# EAGLE schematic cft (EAGLE 5.11), part 6 of 7
## Sheet 44 of 49
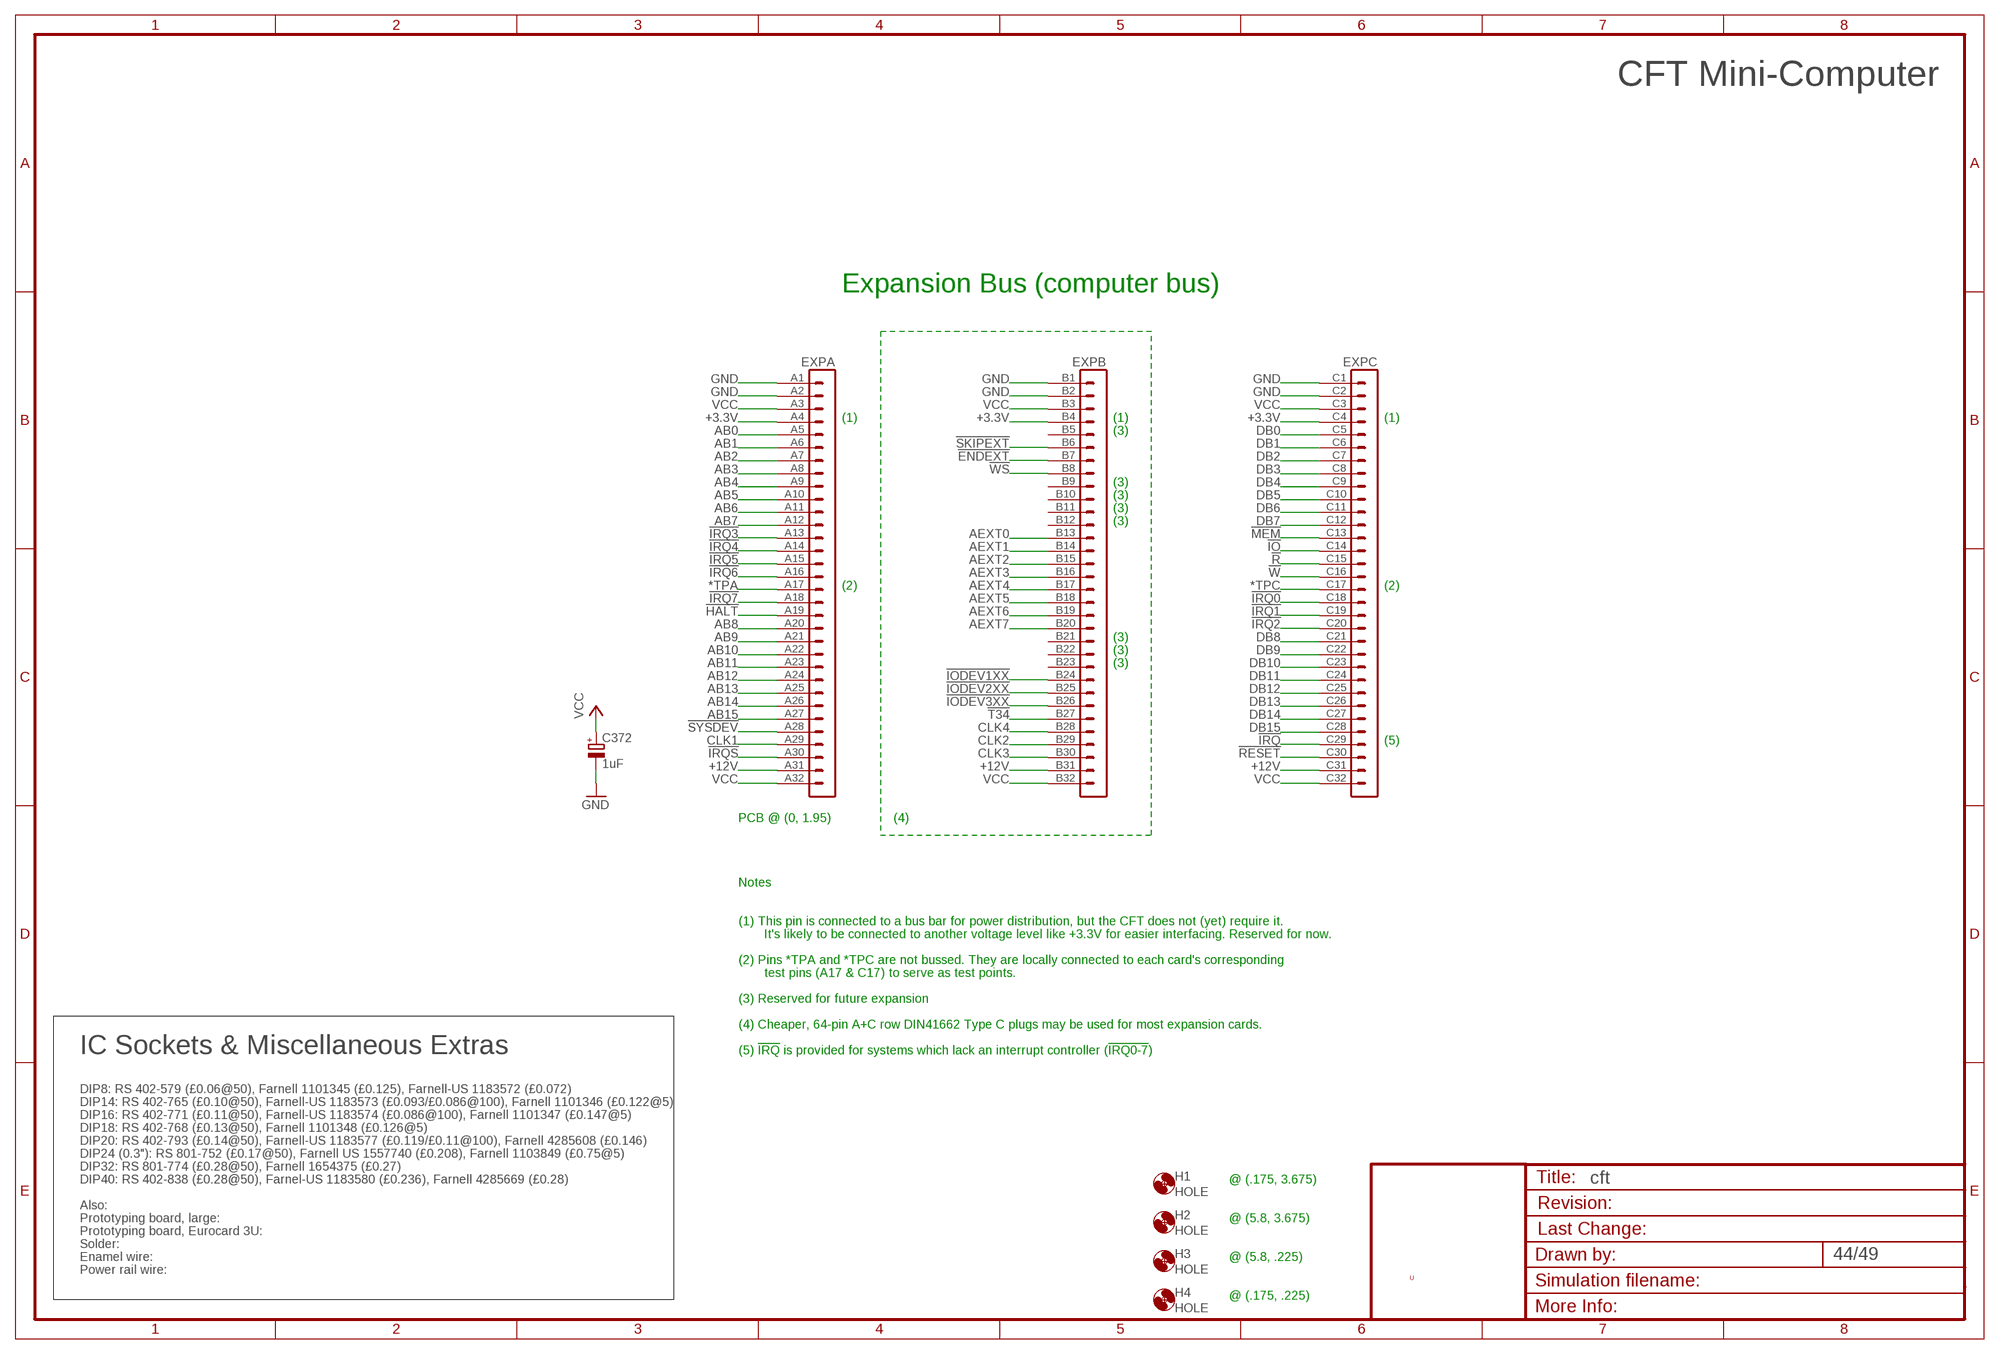
[diagram p43: schematic, sheet 44]

### Parts
C372  1uF  CPOL-EUE2.5-5  [E2,5-5]
EXP  VG96-3K  [VG96K]
H1  HOLE  [STANDOFF_28_60]
H2  HOLE  [STANDOFF_28_60]
H3  HOLE  [STANDOFF_28_60]
H4  HOLE  [STANDOFF_28_60]

### Nets
!ENDEXT: EXP.B7 ; also sheet 4,45,46
!HALT: EXP.A19 ; also sheet 4,43,45,46
!IO: EXP.C14 ; also sheet 4,5,6,12,13,42,45,46
!IODEV1XX: EXP.B24 ; also sheet 13,45,46,47,48
!IODEV2XX: EXP.B25 ; also sheet 13,45,46
!IODEV3XX: EXP.B26 ; also sheet 13,45,46
!IRQ: EXP.C29 ; also sheet 11,22,25,26,27,28,29,30,47
!IRQ0: EXP.C18 ; also sheet 22,25,27,30,45,46
!IRQ1: EXP.C19 ; also sheet 22,25,27,30,45,46
!IRQ2: EXP.C20 ; also sheet 22,25,27,29,30,45,46,47
!IRQ3: EXP.A13 ; also sheet 22,25,29,30,45,46,47
!IRQ4: EXP.A14 ; also sheet 22,25,29,30,45,46,47
!IRQ5: EXP.A15 ; also sheet 22,25,26,28,30,45,46
!IRQ6: EXP.A16 ; also sheet 22,25,26,28,30,45,46
!IRQ7: EXP.A18 ; also sheet 22,25,26,28,30,45,46
!IRQS: EXP.A30 ; also sheet 4,6,11,20,40,45,46
!MEM: EXP.C13 ; also sheet 4,5,6,12,13,21,24,42,45,46
!R: EXP.C15 ; also sheet 4,5,6,12,22,24,25,26,27,28,29,30,41,42,45,46,47,48
!RESET: EXP.C30 ; also sheet 2,3,4,7,8,10,11,12,13,14,17,18,19,20,21,22,25,26,28,29,30,31,45,46,47
!SKIPEXT: EXP.B6 ; also sheet 8,45,46
!SYSDEV: EXP.A28 ; also sheet 13,21,22,25,26,27,28,29,30,41,45,46
!T34: EXP.B27 ; also sheet 2,12,18,45,46
!W: EXP.C16 ; also sheet 12,21,22,24,25,26,27,28,29,30,41,45,46,47,48
!WS: EXP.B8 ; also sheet 4,12,45,46
*TPA: EXP.A17 ; also sheet 45
*TPC: EXP.C17 ; also sheet 45
+3.3V: EXP.A4 EXP.B4 EXP.C4 ; also sheet 45
+12V [LED power]: EXP.A31 EXP.B31 EXP.C31 ; also sheet 28,45
AB0: EXP.A5 ; also sheet 13,21,24,25,26,27,28,29,30,41,45,46,47,48
AB1: EXP.A6 ; also sheet 13,21,24,25,26,27,28,29,30,41,45,46,47,48
AB2: EXP.A7 ; also sheet 13,21,24,25,26,27,29,30,41,45,46,47,48
AB3: EXP.A8 ; also sheet 13,24,25,26,27,28,29,30,41,45,46,47,48
AB4: EXP.A9 ; also sheet 13,22,24,25,26,27,28,29,30,41,45,46,47,48
AB5: EXP.A10 ; also sheet 13,21,22,24,25,26,27,28,29,30,41,45,46,47,48
AB6: EXP.A11 ; also sheet 13,21,22,24,25,26,27,28,29,30,41,45,46,47,48
AB7: EXP.A12 ; also sheet 13,21,22,24,25,26,27,28,29,30,41,45,46,47,48
AB8: EXP.A20 ; also sheet 13,24,45,46
AB9: EXP.A21 ; also sheet 13,24,45,46
AB10: EXP.A22 ; also sheet 13,24,45,46
AB11: EXP.A23 ; also sheet 13,24,45,46
AB12: EXP.A24 ; also sheet 13,24,45,46
AB13: EXP.A25 ; also sheet 13,21,45,46
AB14: EXP.A26 ; also sheet 13,21,45,46
AB15: EXP.A27 ; also sheet 13,21,45,46
AEXT0: EXP.B13 ; also sheet 21,24,45,46
AEXT1: EXP.B14 ; also sheet 21,24,45,46
AEXT2: EXP.B15 ; also sheet 21,24,45,46
AEXT3: EXP.B16 ; also sheet 21,24,45,46
AEXT4: EXP.B17 ; also sheet 21,24,45,46
AEXT5: EXP.B18 ; also sheet 21,24,45,46
AEXT6: EXP.B19 ; also sheet 21,24,45,46
AEXT7: EXP.B20 ; also sheet 21,24,45,46
CLK1: EXP.A29 ; also sheet 2,7,27,31,43,45,46
CLK2: EXP.B29 ; also sheet 2,12,45,46
CLK3: EXP.B30 ; also sheet 2,3,7,17,19,45,46
CLK4: EXP.B28 ; also sheet 2,4,8,12,45,46
DB0: EXP.C5 ; also sheet 12,21,22,24,25,26,27,28,29,30,31,41,45,46,47,48
DB1: EXP.C6 ; also sheet 12,21,22,24,25,26,27,28,29,30,31,41,45,46,47,48
DB2: EXP.C7 ; also sheet 12,21,22,24,25,26,27,28,29,30,31,41,45,46,47,48
DB3: EXP.C8 ; also sheet 12,21,22,24,25,26,27,28,29,30,31,41,45,46,47,48
DB4: EXP.C9 ; also sheet 12,21,22,24,25,26,27,28,29,30,31,41,45,46,47,48
DB5: EXP.C10 ; also sheet 12,21,22,24,25,26,27,28,29,30,31,41,45,46,47,48
DB6: EXP.C11 ; also sheet 12,21,22,24,25,26,27,28,29,30,31,41,45,46,47,48
DB7: EXP.C12 ; also sheet 12,21,22,24,25,26,27,28,29,30,31,41,45,46,47,48
DB8: EXP.C21 ; also sheet 12,21,24,26,27,29,30,31,41,45,46,48
DB9: EXP.C22 ; also sheet 12,24,26,27,29,30,41,45,46,48
DB10: EXP.C23 ; also sheet 12,24,26,27,29,30,41,45,46,48
DB11: EXP.C24 ; also sheet 12,24,26,27,29,30,41,45,46,48
DB12: EXP.C25 ; also sheet 12,24,26,27,29,30,41,45,46,48
DB13: EXP.C26 ; also sheet 12,24,26,27,29,30,41,45,46,48
DB14: EXP.C27 ; also sheet 12,24,26,27,29,30,41,45,46,48
DB15: EXP.C28 ; also sheet 12,24,26,27,29,30,41,45,46,48
GND [low power]: C372.- EXP.A1 EXP.A2 EXP.B1 EXP.B2 EXP.C1 EXP.C2 ; also sheet 2,3,4,5,6,7,8,9,10,11,12,13,14,15,16,17,18,19,20,21,22,24,25,26,27,28,29,30,31,32,33,34,35,36,37,38,39,40,41,42,43,45,46,47,48,49
VCC [low power]: C372.+ EXP.A3 EXP.A32 EXP.B3 EXP.B32 EXP.C3 EXP.C32 ; also sheet 2,3,4,6,7,8,9,10,11,12,13,14,15,16,17,18,19,20,21,22,24,25,26,27,28,29,30,31,34,35,36,37,38,39,40,41,42,43,45,46,47,48,49
Unconnected: EXP.B5 EXP.B9 EXP.B10 EXP.B11 EXP.B12 EXP.B21 EXP.B22 EXP.B23

### Notes on the sheet
- CFT Mini-Computer
- Expansion Bus (computer bus)
- (1) | (1) | (1)
- (3)
- (3)
- (3)
- (3)
- (3)
- (2) | (2)
- (3)
- (3)
- (3)
- (5)
- PCB @ (0, 1.95) | (4)
- Notes
- (1) This pin is connected to a bus bar for power distribution, but the CFT does not (yet) require it.
- It's likely to be connected to another voltage level like +3.3V for easier interfacing. Reserved for now.
- (2) Pins *TPA and *TPC are not bussed. They are locally connected to each card's corresponding
- test pins (A17 & C17) to serve as test points.
- (3) Reserved for future expansion
- (4) Cheaper, 64-pin A+C row DIN41662 Type C plugs may be used for most expansion cards.
- IC Sockets & Miscellaneous Extras | (5) !IRQ! is provided for systems which lack an interrupt controller (!IRQ0-7!)
- DIP8: RS 402-579 (£0.06@50), Farnell 1101345 (£0.125), Farnell-US 1183572 (£0.072)
- DIP14: RS 402-765 (£0.10@50), Farnell-US 1183573 (£0.093/£0.086@100), Farnell 1101346 (£0.122@5)
- DIP16: RS 402-771 (£0.11@50), Farnell-US 1183574 (£0.086@100), Farnell 1101347 (£0.147@5)
- DIP18: RS 402-768 (£0.13@50), Farnell 1101348 (£0.126@5)
- DIP20: RS 402-793 (£0.14@50), Farnell-US 1183577 (£0.119/£0.11@100), Farnell 4285608 (£0.146)
- DIP24 (0.3"): RS 801-752 (£0.17@50), Farnell US 1557740 (£0.208), Farnell 1103849 (£0.75@5)
- DIP32: RS 801-774 (£0.28@50), Farnell 1654375 (£0.27)
- DIP40: RS 402-838 (£0.28@50), Farnel-US 1183580 (£0.236), Farnell 4285669 (£0.28) | @ (.175, 3.675)
- Also:
- Prototyping board, large: | @ (5.8, 3.675)
- Prototyping board, Eurocard 3U:
- Solder:
- Enamel wire: | @ (5.8, .225)
- Power rail wire:
- U
- @ (.175, .225)

## Sheet 45 of 49
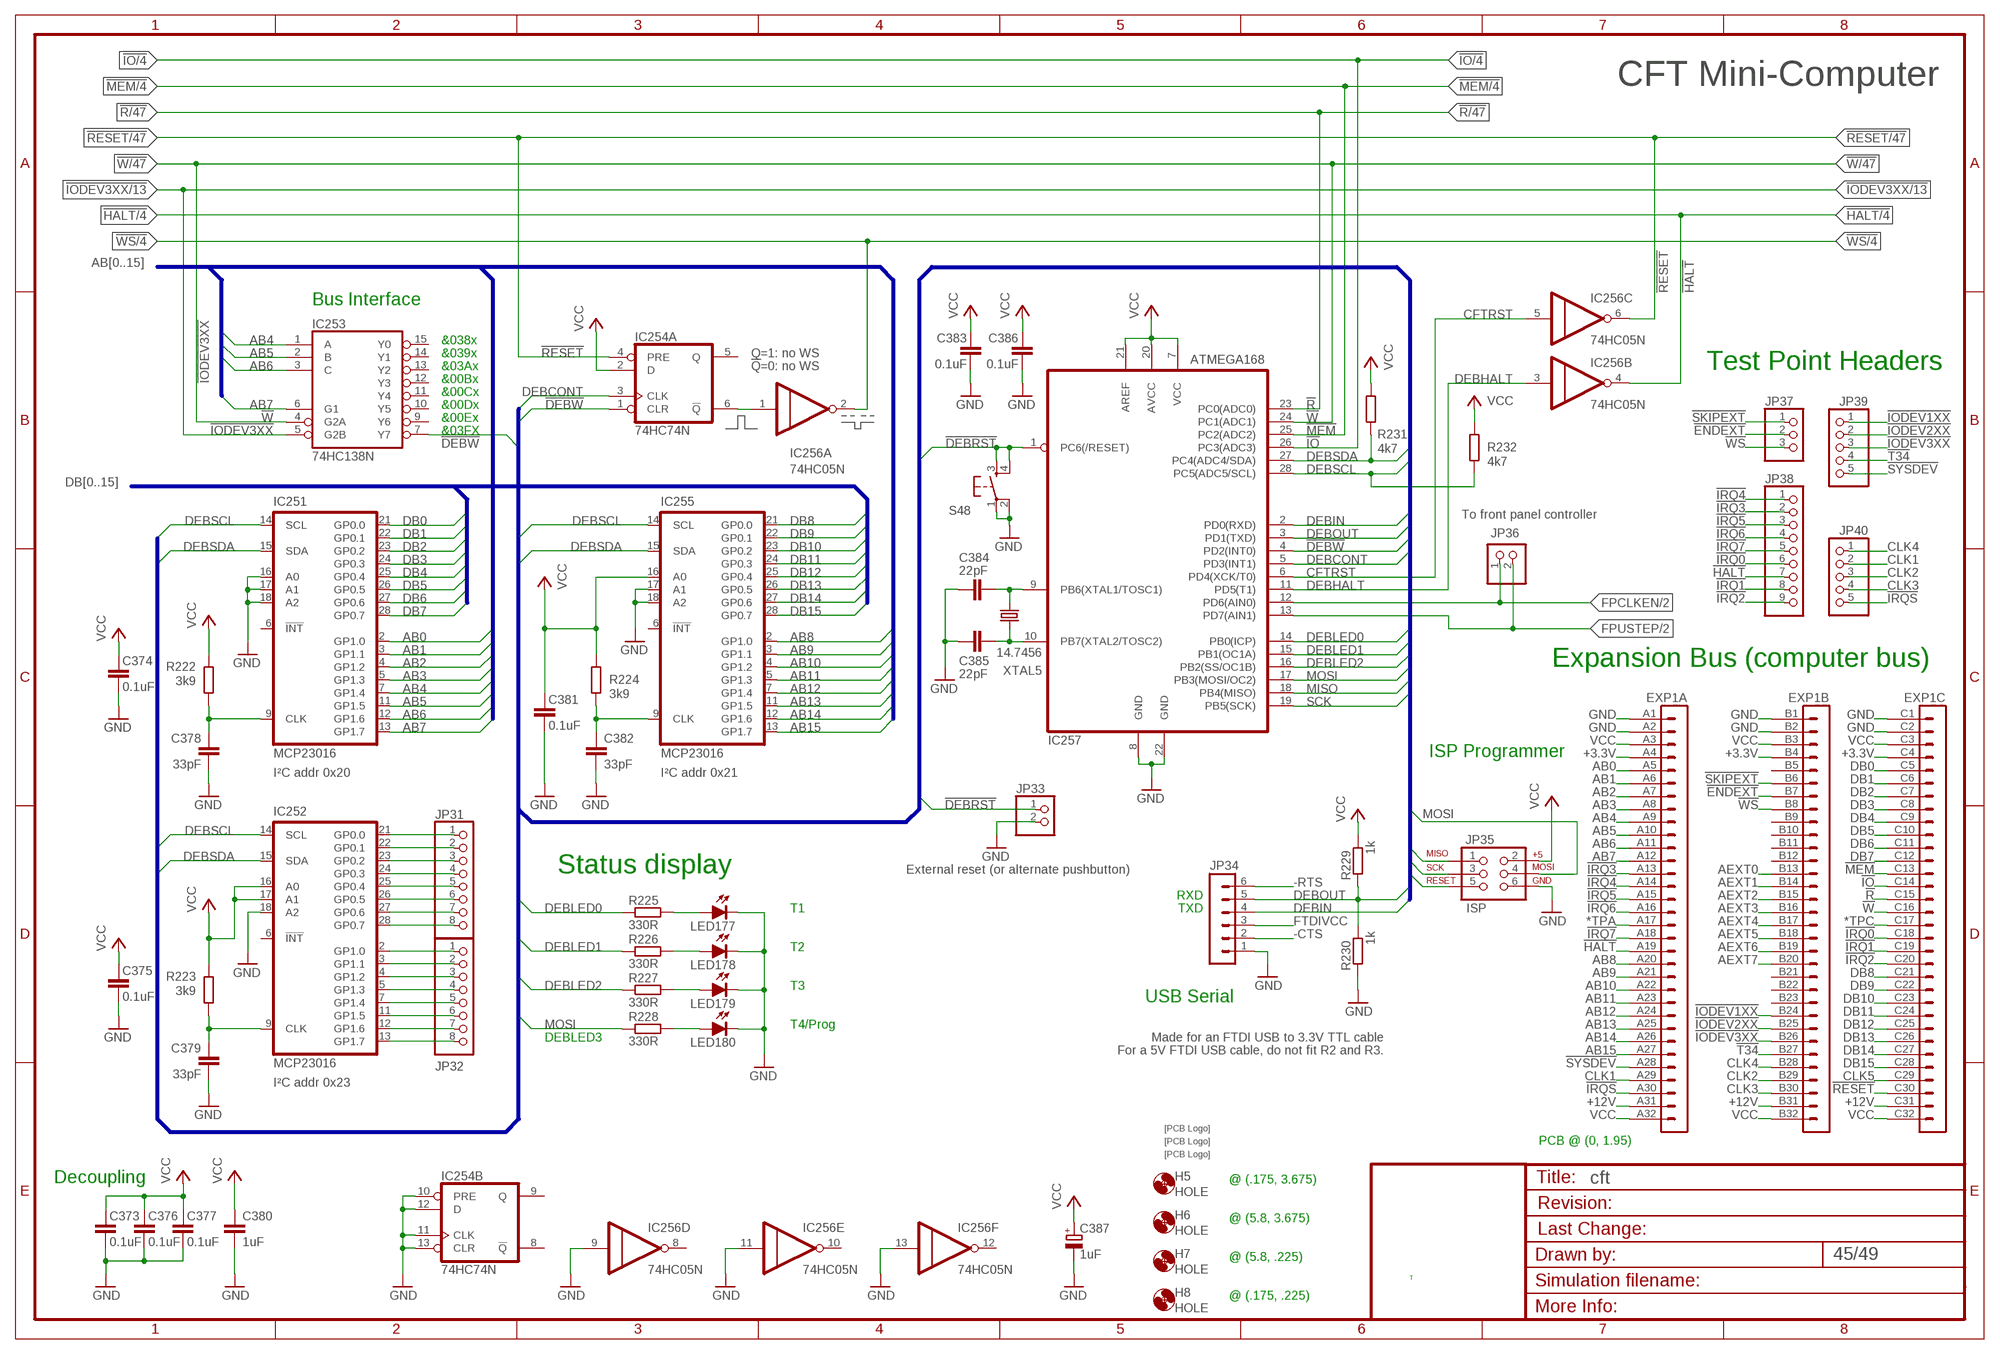
[diagram p44: schematic, sheet 45]

### Parts
C373  0.1uF  C-EU025-024X044  [C025-024X044]
C374  0.1uF  C-EU025-024X044  [C025-024X044]
C375  0.1uF  C-EU025-024X044  [C025-024X044]
C376  0.1uF  C-EU025-024X044  [C025-024X044]
C377  0.1uF  C-EU025-024X044  [C025-024X044]
C378  33pF  C-EU025-024X044  [C025-024X044]
C379  33pF  C-EU025-024X044  [C025-024X044]
C380  1uF  C-EU025-024X044  [C025-024X044]
C381  0.1uF  C-EU025-024X044  [C025-024X044]
C382  33pF  C-EU025-024X044  [C025-024X044]
C383  0.1uF  C-EU025-024X044  [C025-024X044]
C384  22pF  C-EU025-024X044  [C025-024X044]
C385  22pF  C-EU025-024X044  [C025-024X044]
C386  0.1uF  C-EU025-024X044  [C025-024X044]
C387  1uF  CPOL-EUE2.5-5  [E2,5-5]
EXP1  VG96-3K  [VG96K]
H5  HOLE  [STANDOFF_28_60]
H6  HOLE  [STANDOFF_28_60]
H7  HOLE  [STANDOFF_28_60]
H8  HOLE  [STANDOFF_28_60]
IC251  MCP23016  [DIL28-6]
IC252  MCP23016  [DIL28-6]
IC253  74HC138N  [DIL16]
IC254  74HC74N  [DIL14]
IC255  MCP23016  [DIL28-6]
IC256  74HC05N  [DIL14]
IC257  ATMEGA168  MEGA8-P  [DIL28-3]
JP31  PINHD-1X8  [1X08]
JP32  PINHD-1X8  [1X08]
JP33  PINHD-1X2  [1X02]
JP34  MA06-1  [MA06-1]
JP35  ISP  AVR_SPI_PRG_6NS  [2X3-NS]
JP36  PINHD-1X2  [1X02]
JP37  PINHD-1X3  [1X03]
JP38  PINHD-1X9  [1X09]
JP39  PINHD-1X5  [1X05]
JP40  PINHD-1X5  [1X05]
LED177  LED-5MM-RED  [LED5MM]
LED178  LED-5MM-RED  [LED5MM]
LED179  LED-5MM-RED  [LED5MM]
LED180  LED-5MM-RED  [LED5MM]
R222  3k9  R-EU_0207/7  [0207/7]
R223  3k9  R-EU_0207/7  [0207/7]
R224  3k9  R-EU_0207/7  [0207/7]
R225  330R  R-EU_0207/7  [0207/7]
R226  330R  R-EU_0207/7  [0207/7]
R227  330R  R-EU_0207/7  [0207/7]
R228  330R  R-EU_0207/7  [0207/7]
R229  1k  R-EU_0207/7  [0207/7]
R230  1k  R-EU_0207/7  [0207/7]
R231  4k7  R-EU_0207/7  [0207/7]
R232  4k7  R-EU_0207/7  [0207/7]
S48  TAC_SWITCHPTH  [TACTILE-PTH]
U$1  SIGNATURESILK  [SIGNATURE]
U$2  SIGNATUREPLANE  [SIGNATURE_PLANE]
U$3  SIGNATUREPLANE  [SIGNATURE_PLANE]
XTAL5  14.7456  CRYSTALHC49U-V  [HC49U-V]

### Nets
!DEBRST: IC257.1(PC6(/RESET)) JP33.1 JP35.5 S48.3 S48.4
!DEBW: IC253.7(Y7) IC254.1(A:CLR) IC257.4(PD2(INT0))
!ENDEXT: EXP1.B7 JP37.2 ; also sheet 4,44,46
!HALT: EXP1.A19 IC256.4(B:O) JP38.7 ; also sheet 4,43,44,46
!IO: EXP1.C14 IC257.26(PC3(ADC3)) ; also sheet 4,5,6,12,13,42,44,46
!IODEV1XX: EXP1.B24 JP39.1 ; also sheet 13,44,46,47,48
!IODEV2XX: EXP1.B25 JP39.2 ; also sheet 13,44,46
!IODEV3XX: EXP1.B26 IC253.5(G2B) JP39.3 ; also sheet 13,44,46
!IRQ0: EXP1.C18 JP38.6 ; also sheet 22,25,27,30,44,46
!IRQ1: EXP1.C19 JP38.8 ; also sheet 22,25,27,30,44,46
!IRQ2: EXP1.C20 JP38.9 ; also sheet 22,25,27,29,30,44,46,47
!IRQ3: EXP1.A13 JP38.2 ; also sheet 22,25,29,30,44,46,47
!IRQ4: EXP1.A14 JP38.1 ; also sheet 22,25,29,30,44,46,47
!IRQ5: EXP1.A15 JP38.3 ; also sheet 22,25,26,28,30,44,46
!IRQ6: EXP1.A16 JP38.4 ; also sheet 22,25,26,28,30,44,46
!IRQ7: EXP1.A18 JP38.5 ; also sheet 22,25,26,28,30,44,46
!IRQS: EXP1.A30 JP40.5 ; also sheet 4,6,11,20,40,44,46
!MEM: EXP1.C13 IC257.25(PC2(ADC2)) ; also sheet 4,5,6,12,13,21,24,42,44,46
!R: EXP1.C15 IC257.23(PC0(ADC0)) ; also sheet 4,5,6,12,22,24,25,26,27,28,29,30,41,42,44,46,47,48
!RESET: EXP1.C30 IC254.4(A:PRE) IC256.6(C:O) ; also sheet 2,3,4,7,8,10,11,12,13,14,17,18,19,20,21,22,25,26,28,29,30,31,44,46,47
!SKIPEXT: EXP1.B6 JP37.1 ; also sheet 8,44,46
!SYSDEV: EXP1.A28 JP39.5 ; also sheet 13,21,22,25,26,27,28,29,30,41,44,46
!T34: EXP1.B27 JP39.4 ; also sheet 2,12,18,44,46
!W: EXP1.C16 IC253.4(G2A) IC257.24(PC1(ADC1)) ; also sheet 12,21,22,24,25,26,27,28,29,30,41,44,46,47,48
!WS: EXP1.B8 IC256.2(A:O) JP37.3 ; also sheet 4,12,44,46
*TPA: EXP1.A17 ; also sheet 44
*TPC: EXP1.C17 ; also sheet 44
+3.3V: EXP1.A4 EXP1.B4 EXP1.C4 ; also sheet 44
+12V [LED power]: EXP1.A31 EXP1.B31 EXP1.C31 ; also sheet 28,44
-CTS: JP34.2
-RTS: JP34.6
AB0: EXP1.A5 IC251.2(GP1.0) ; also sheet 13,21,24,25,26,27,28,29,30,41,44,46,47,48
AB1: EXP1.A6 IC251.3(GP1.1) ; also sheet 13,21,24,25,26,27,28,29,30,41,44,46,47,48
AB2: EXP1.A7 IC251.4(GP1.2) ; also sheet 13,21,24,25,26,27,29,30,41,44,46,47,48
AB3: EXP1.A8 IC251.5(GP1.3) ; also sheet 13,24,25,26,27,28,29,30,41,44,46,47,48
AB4: EXP1.A9 IC251.7(GP1.4) IC253.1(A) ; also sheet 13,22,24,25,26,27,28,29,30,41,44,46,47,48
AB5: EXP1.A10 IC251.11(GP1.5) IC253.2(B) ; also sheet 13,21,22,24,25,26,27,28,29,30,41,44,46,47,48
AB6: EXP1.A11 IC251.12(GP1.6) IC253.3(C) ; also sheet 13,21,22,24,25,26,27,28,29,30,41,44,46,47,48
AB7: EXP1.A12 IC251.13(GP1.7) IC253.6(G1) ; also sheet 13,21,22,24,25,26,27,28,29,30,41,44,46,47,48
AB8: EXP1.A20 IC255.2(GP1.0) ; also sheet 13,24,44,46
AB9: EXP1.A21 IC255.3(GP1.1) ; also sheet 13,24,44,46
AB10: EXP1.A22 IC255.4(GP1.2) ; also sheet 13,24,44,46
AB11: EXP1.A23 IC255.5(GP1.3) ; also sheet 13,24,44,46
AB12: EXP1.A24 IC255.7(GP1.4) ; also sheet 13,24,44,46
AB13: EXP1.A25 IC255.11(GP1.5) ; also sheet 13,21,44,46
AB14: EXP1.A26 IC255.12(GP1.6) ; also sheet 13,21,44,46
AB15: EXP1.A27 IC255.13(GP1.7) ; also sheet 13,21,44,46
AEXT0: EXP1.B13 ; also sheet 21,24,44,46
AEXT1: EXP1.B14 ; also sheet 21,24,44,46
AEXT2: EXP1.B15 ; also sheet 21,24,44,46
AEXT3: EXP1.B16 ; also sheet 21,24,44,46
AEXT4: EXP1.B17 ; also sheet 21,24,44,46
AEXT5: EXP1.B18 ; also sheet 21,24,44,46
AEXT6: EXP1.B19 ; also sheet 21,24,44,46
AEXT7: EXP1.B20 ; also sheet 21,24,44,46
CFTRST: IC256.5(C:I) IC257.6(PD4(XCK/T0))
CLK1: EXP1.A29 JP40.2 ; also sheet 2,7,27,31,43,44,46
CLK2: EXP1.B29 JP40.3 ; also sheet 2,12,44,46
CLK3: EXP1.B30 JP40.4 ; also sheet 2,3,7,17,19,44,46
CLK4: EXP1.B28 JP40.1 ; also sheet 2,4,8,12,44,46
CLK5: EXP1.C29
DB0: EXP1.C5 IC251.21(GP0.0) ; also sheet 12,21,22,24,25,26,27,28,29,30,31,41,44,46,47,48
DB1: EXP1.C6 IC251.22(GP0.1) ; also sheet 12,21,22,24,25,26,27,28,29,30,31,41,44,46,47,48
DB2: EXP1.C7 IC251.23(GP0.2) ; also sheet 12,21,22,24,25,26,27,28,29,30,31,41,44,46,47,48
DB3: EXP1.C8 IC251.24(GP0.3) ; also sheet 12,21,22,24,25,26,27,28,29,30,31,41,44,46,47,48
DB4: EXP1.C9 IC251.25(GP0.4) ; also sheet 12,21,22,24,25,26,27,28,29,30,31,41,44,46,47,48
DB5: EXP1.C10 IC251.26(GP0.5) ; also sheet 12,21,22,24,25,26,27,28,29,30,31,41,44,46,47,48
DB6: EXP1.C11 IC251.27(GP0.6) ; also sheet 12,21,22,24,25,26,27,28,29,30,31,41,44,46,47,48
DB7: EXP1.C12 IC251.28(GP0.7) ; also sheet 12,21,22,24,25,26,27,28,29,30,31,41,44,46,47,48
DB8: EXP1.C21 IC255.21(GP0.0) ; also sheet 12,21,24,26,27,29,30,31,41,44,46,48
DB9: EXP1.C22 IC255.22(GP0.1) ; also sheet 12,24,26,27,29,30,41,44,46,48
DB10: EXP1.C23 IC255.23(GP0.2) ; also sheet 12,24,26,27,29,30,41,44,46,48
DB11: EXP1.C24 IC255.24(GP0.3) ; also sheet 12,24,26,27,29,30,41,44,46,48
DB12: EXP1.C25 IC255.25(GP0.4) ; also sheet 12,24,26,27,29,30,41,44,46,48
DB13: EXP1.C26 IC255.26(GP0.5) ; also sheet 12,24,26,27,29,30,41,44,46,48
DB14: EXP1.C27 IC255.27(GP0.6) ; also sheet 12,24,26,27,29,30,41,44,46,48
DB15: EXP1.C28 IC255.28(GP0.7) ; also sheet 12,24,26,27,29,30,41,44,46,48
DEBCONT: IC254.3(A:CLK) IC257.5(PD3(INT1))
DEBHALT: IC256.3(B:I) IC257.11(PD5(T1))
DEBIN: IC257.2(PD0(RXD)) JP34.4
DEBLED0: IC257.14(PB0(ICP)) R225.1
DEBLED1: IC257.15(PB1(OC1A)) R226.1
DEBLED2: IC257.16(PB2(SS/OC1B)) R227.1
DEBOUT: IC257.3(PD1(TXD)) JP34.5 R229.1 R230.2
DEBSCL: IC251.14(SCL) IC252.14(SCL) IC255.14(SCL) IC257.28(PC5(ADC5/SCL)) R232.2
DEBSDA: IC251.15(SDA) IC252.15(SDA) IC255.15(SDA) IC257.27(PC4(ADC4/SDA)) R231.2
FPCLKEN: IC257.12(PD6(AIN0)) JP36.1 ; also sheet 2,6,35,43
FPUSTEP: IC257.13(PD7(AIN1)) JP36.2 ; also sheet 2,6,35,40
FTDIVCC: JP34.3
GND [low power]: C373.1 C374.1 C375.1 C376.1 C377.1 C378.2 C379.2 C380.2 C381.1 C382.2 C383.1 C384.2 C385.2 C386.1 C387.- EXP1.A1 EXP1.A2 EXP1.B1 EXP1.B2 EXP1.C1 EXP1.C2 IC251.16(A0) IC251.17(A1) IC251.18(A2) IC252.18(A2) IC254.10(B:PRE) IC254.11(B:CLK) IC254.12(B:D) IC254.13(B:CLR) IC255.17(A1) IC255.18(A2) IC256.9(D:I) IC256.11(E:I) IC256.13(F:I) IC257.8(GND) IC257.22(GND) JP33.2 JP34.1 JP35.6 LED177.K(C) LED178.K(C) LED179.K(C) LED180.K(C) R230.1 S48.1 S48.2 ; also sheet 2,3,4,5,6,7,8,9,10,11,12,13,14,15,16,17,18,19,20,21,22,24,25,26,27,28,29,30,31,32,33,34,35,36,37,38,39,40,41,42,43,44,46,47,48,49
MISO: IC257.18(PB4(MISO)) JP35.1
MOSI: IC257.17(PB3(MOSI/OC2)) JP35.4 R228.1
N$110: C384.1 IC257.9(PB6(XTAL1/TOSC1)) XTAL5.1
N$111: C385.1 IC257.10(PB7(XTAL2/TOSC2)) XTAL5.2
N$112: IC254.6(A:!Q) IC256.1(A:I)
N$114: LED177.A R225.2
N$454: C378.1 IC251.9(CLK) R222.2
N$455: LED178.A R226.2
N$456: C382.1 IC255.9(CLK) R224.2
N$457: C379.1 IC252.9(CLK) R223.2
N$462: IC252.21(GP0.0) JP31.1
N$467: LED179.A R227.2
N$481: LED180.A R228.2
N$539: IC252.22(GP0.1) JP31.2
N$541: IC252.23(GP0.2) JP31.3
N$682: IC252.24(GP0.3) JP31.4
N$686: IC252.25(GP0.4) JP31.5
N$690: IC252.26(GP0.5) JP31.6
N$692: IC252.27(GP0.6) JP31.7
N$693: IC252.28(GP0.7) JP31.8
N$694: IC252.2(GP1.0) JP32.1
N$695: IC252.3(GP1.1) JP32.2
N$697: IC252.4(GP1.2) JP32.3
N$698: IC252.5(GP1.3) JP32.4
N$699: IC252.7(GP1.4) JP32.5
N$845: IC252.11(GP1.5) JP32.6
N$846: IC252.12(GP1.6) JP32.7
N$847: IC252.13(GP1.7) JP32.8
SCK: IC257.19(PB5(SCK)) JP35.3
VCC [low power]: C373.2 C374.2 C375.2 C376.2 C377.2 C380.1 C381.2 C383.2 C386.2 C387.+ EXP1.A3 EXP1.A32 EXP1.B3 EXP1.B32 EXP1.C3 EXP1.C32 IC252.16(A0) IC252.17(A1) IC254.2(A:D) IC255.16(A0) IC257.7(VCC) IC257.20(AVCC) IC257.21(AREF) JP35.2 R222.1 R223.1 R224.1 R229.2 R231.1 R232.1 ; also sheet 2,3,4,6,7,8,9,10,11,12,13,14,15,16,17,18,19,20,21,22,24,25,26,27,28,29,30,31,34,35,36,37,38,39,40,41,42,43,44,46,47,48,49
Unconnected: EXP1.B5 EXP1.B9 EXP1.B10 EXP1.B11 EXP1.B12 EXP1.B21 EXP1.B22 EXP1.B23 IC251.6(!INT) IC252.6(!INT) IC253.9(Y6) IC253.10(Y5) IC253.11(Y4) IC253.12(Y3) IC253.13(Y2) IC253.14(Y1) IC253.15(Y0) IC254.5(A:Q) IC254.8(B:!Q) IC254.9(B:Q) IC255.6(!INT) IC256.8(D:O) IC256.10(E:O) IC256.12(F:O)

### Buses
AB[0..15]
DB[0..15]
!DEBW,!DEBCONT,DEBSCL,DEBSDA,DEBIN,DEBOUT,MOSI,MISO,SCK,!DEBRST,DEBLED[0..3]
!DEBW,!DEBCONT,DEBSCL,DEBSDA,DEBIN,DEBOUT,MOSI,MISO,SCK,!DEBRST,DEBLED[0..3],!R,!W,!MEM,!IO

### Notes on the sheet
- CFT Mini-Computer
- Bus Interface
- &038x
- &039x | Q=1: no WS
- &03Ax | !Q!=0: no WS | Test Point Headers
- &00Bx
- &00Cx
- &00Dx
- &00Ex
- &03FX
- To front panel controller
- Expansion Bus (computer bus)
- ISP Programmer
- I²C addr 0x20 | I²C addr 0x21
- Status display | External reset (or alternate pushbutton)
- RXD
- T1 | TXD
- T2
- T3
- USB Serial
- T4/Prog
- DEBLED3 | Made for an FTDI USB to 3.3V TTL cable
- For a 5V FTDI USB cable, do not fit R2 and R3.
- I²C addr 0x23
- PCB @ (0, 1.95)
- Decoupling | @ (.175, 3.675)
- @ (5.8, 3.675)
- @ (5.8, .225)
- T
- @ (.175, .225)

## Sheet 46 of 49
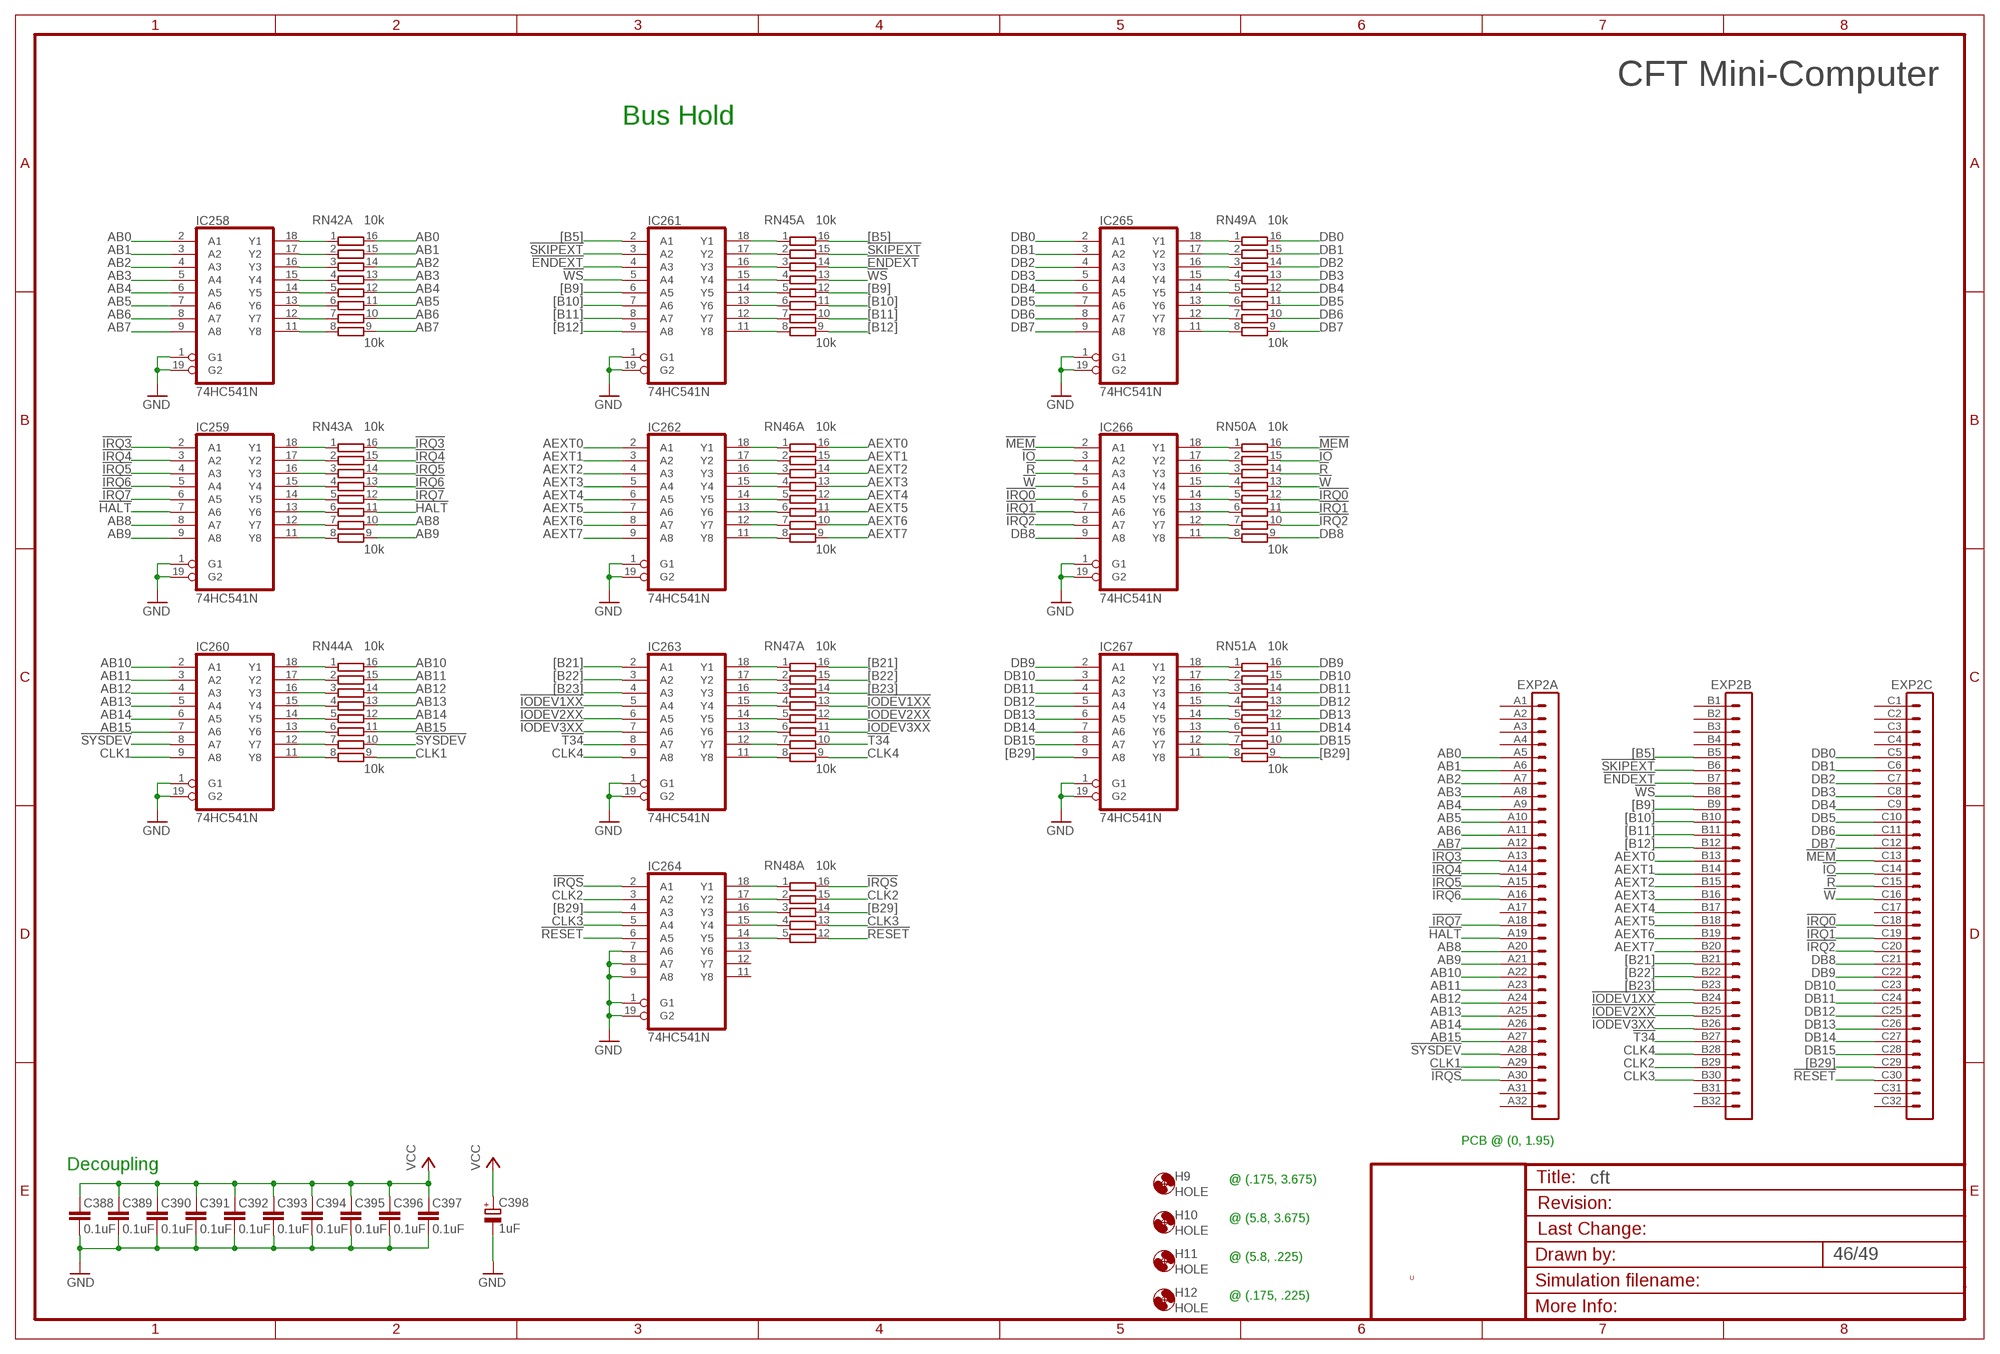
[diagram p45: schematic, sheet 46]

### Parts
C388  0.1uF  C-EU025-024X044  [C025-024X044]
C389  0.1uF  C-EU025-024X044  [C025-024X044]
C390  0.1uF  C-EU025-024X044  [C025-024X044]
C391  0.1uF  C-EU025-024X044  [C025-024X044]
C392  0.1uF  C-EU025-024X044  [C025-024X044]
C393  0.1uF  C-EU025-024X044  [C025-024X044]
C394  0.1uF  C-EU025-024X044  [C025-024X044]
C395  0.1uF  C-EU025-024X044  [C025-024X044]
C396  0.1uF  C-EU025-024X044  [C025-024X044]
C397  0.1uF  C-EU025-024X044  [C025-024X044]
C398  1uF  CPOL-EUE2.5-5  [E2,5-5]
EXP2  VG96-3K  [VG96K]
H9  HOLE  [STANDOFF_28_60]
H10  HOLE  [STANDOFF_28_60]
H11  HOLE  [STANDOFF_28_60]
H12  HOLE  [STANDOFF_28_60]
IC258  74HC541N  [DIL20]
IC259  74HC541N  [DIL20]
IC260  74HC541N  [DIL20]
IC261  74HC541N  [DIL20]
IC262  74HC541N  [DIL20]
IC263  74HC541N  [DIL20]
IC264  74HC541N  [DIL20]
IC265  74HC541N  [DIL20]
IC266  74HC541N  [DIL20]
IC267  74HC541N  [DIL20]
RN42  10k  8R-N  [DIL16]
RN43  10k  8R-N  [DIL16]
RN44  10k  8R-N  [DIL16]
RN45  10k  8R-N  [DIL16]
RN46  10k  8R-N  [DIL16]
RN47  10k  8R-N  [DIL16]
RN48  10k  8R-N  [DIL16]
RN49  10k  8R-N  [DIL16]
RN50  10k  8R-N  [DIL16]
RN51  10k  8R-N  [DIL16]

### Nets
!ENDEXT: EXP2.B7 IC261.4(A3) RN45.14 ; also sheet 4,44,45
!HALT: EXP2.A19 IC259.7(A6) RN43.11 ; also sheet 4,43,44,45
!IO: EXP2.C14 IC266.3(A2) RN50.15 ; also sheet 4,5,6,12,13,42,44,45
!IODEV1XX: EXP2.B24 IC263.5(A4) RN47.13 ; also sheet 13,44,45,47,48
!IODEV2XX: EXP2.B25 IC263.6(A5) RN47.12 ; also sheet 13,44,45
!IODEV3XX: EXP2.B26 IC263.7(A6) RN47.11 ; also sheet 13,44,45
!IRQ0: EXP2.C18 IC266.6(A5) RN50.12 ; also sheet 22,25,27,30,44,45
!IRQ1: EXP2.C19 IC266.7(A6) RN50.11 ; also sheet 22,25,27,30,44,45
!IRQ2: EXP2.C20 IC266.8(A7) RN50.10 ; also sheet 22,25,27,29,30,44,45,47
!IRQ3: EXP2.A13 IC259.2(A1) RN43.16 ; also sheet 22,25,29,30,44,45,47
!IRQ4: EXP2.A14 IC259.3(A2) RN43.15 ; also sheet 22,25,29,30,44,45,47
!IRQ5: EXP2.A15 IC259.4(A3) RN43.14 ; also sheet 22,25,26,28,30,44,45
!IRQ6: EXP2.A16 IC259.5(A4) RN43.13 ; also sheet 22,25,26,28,30,44,45
!IRQ7: EXP2.A18 IC259.6(A5) RN43.12 ; also sheet 22,25,26,28,30,44,45
!IRQS: EXP2.A30 IC264.2(A1) RN48.16 ; also sheet 4,6,11,20,40,44,45
!MEM: EXP2.C13 IC266.2(A1) RN50.16 ; also sheet 4,5,6,12,13,21,24,42,44,45
!R: EXP2.C15 IC266.4(A3) RN50.14 ; also sheet 4,5,6,12,22,24,25,26,27,28,29,30,41,42,44,45,47,48
!RESET: EXP2.C30 IC264.6(A5) RN48.12 ; also sheet 2,3,4,7,8,10,11,12,13,14,17,18,19,20,21,22,25,26,28,29,30,31,44,45,47
!SKIPEXT: EXP2.B6 IC261.3(A2) RN45.15 ; also sheet 8,44,45
!SYSDEV: EXP2.A28 IC260.8(A7) RN44.10 ; also sheet 13,21,22,25,26,27,28,29,30,41,44,45
!T34: EXP2.B27 IC263.8(A7) RN47.10 ; also sheet 2,12,18,44,45
!W: EXP2.C16 IC266.5(A4) RN50.13 ; also sheet 12,21,22,24,25,26,27,28,29,30,41,44,45,47,48
!WS: EXP2.B8 IC261.5(A4) RN45.13 ; also sheet 4,12,44,45
[B5]: EXP2.B5 IC261.2(A1) RN45.16
[B9]: EXP2.B9 IC261.6(A5) RN45.12
[B10]: EXP2.B10 IC261.7(A6) RN45.11
[B11]: EXP2.B11 IC261.8(A7) RN45.10
[B12]: EXP2.B12 IC261.9(A8) RN45.9
[B21]: EXP2.B21 IC263.2(A1) RN47.16
[B22]: EXP2.B22 IC263.3(A2) RN47.15
[B23]: EXP2.B23 IC263.4(A3) RN47.14
[B29]: EXP2.C29 IC264.4(A3) IC267.9(A8) RN48.14 RN51.9
AB0: EXP2.A5 IC258.2(A1) RN42.16 ; also sheet 13,21,24,25,26,27,28,29,30,41,44,45,47,48
AB1: EXP2.A6 IC258.3(A2) RN42.15 ; also sheet 13,21,24,25,26,27,28,29,30,41,44,45,47,48
AB2: EXP2.A7 IC258.4(A3) RN42.14 ; also sheet 13,21,24,25,26,27,29,30,41,44,45,47,48
AB3: EXP2.A8 IC258.5(A4) RN42.13 ; also sheet 13,24,25,26,27,28,29,30,41,44,45,47,48
AB4: EXP2.A9 IC258.6(A5) RN42.12 ; also sheet 13,22,24,25,26,27,28,29,30,41,44,45,47,48
AB5: EXP2.A10 IC258.7(A6) RN42.11 ; also sheet 13,21,22,24,25,26,27,28,29,30,41,44,45,47,48
AB6: EXP2.A11 IC258.8(A7) RN42.10 ; also sheet 13,21,22,24,25,26,27,28,29,30,41,44,45,47,48
AB7: EXP2.A12 IC258.9(A8) RN42.9 ; also sheet 13,21,22,24,25,26,27,28,29,30,41,44,45,47,48
AB8: EXP2.A20 IC259.8(A7) RN43.10 ; also sheet 13,24,44,45
AB9: EXP2.A21 IC259.9(A8) RN43.9 ; also sheet 13,24,44,45
AB10: EXP2.A22 IC260.2(A1) RN44.16 ; also sheet 13,24,44,45
AB11: EXP2.A23 IC260.3(A2) RN44.15 ; also sheet 13,24,44,45
AB12: EXP2.A24 IC260.4(A3) RN44.14 ; also sheet 13,24,44,45
AB13: EXP2.A25 IC260.5(A4) RN44.13 ; also sheet 13,21,44,45
AB14: EXP2.A26 IC260.6(A5) RN44.12 ; also sheet 13,21,44,45
AB15: EXP2.A27 IC260.7(A6) RN44.11 ; also sheet 13,21,44,45
AEXT0: EXP2.B13 IC262.2(A1) RN46.16 ; also sheet 21,24,44,45
AEXT1: EXP2.B14 IC262.3(A2) RN46.15 ; also sheet 21,24,44,45
AEXT2: EXP2.B15 IC262.4(A3) RN46.14 ; also sheet 21,24,44,45
AEXT3: EXP2.B16 IC262.5(A4) RN46.13 ; also sheet 21,24,44,45
AEXT4: EXP2.B17 IC262.6(A5) RN46.12 ; also sheet 21,24,44,45
AEXT5: EXP2.B18 IC262.7(A6) RN46.11 ; also sheet 21,24,44,45
AEXT6: EXP2.B19 IC262.8(A7) RN46.10 ; also sheet 21,24,44,45
AEXT7: EXP2.B20 IC262.9(A8) RN46.9 ; also sheet 21,24,44,45
CLK1: EXP2.A29 IC260.9(A8) RN44.9 ; also sheet 2,7,27,31,43,44,45
CLK2: EXP2.B29 IC264.3(A2) RN48.15 ; also sheet 2,12,44,45
CLK3: EXP2.B30 IC264.5(A4) RN48.13 ; also sheet 2,3,7,17,19,44,45
CLK4: EXP2.B28 IC263.9(A8) RN47.9 ; also sheet 2,4,8,12,44,45
DB0: EXP2.C5 IC265.2(A1) RN49.16 ; also sheet 12,21,22,24,25,26,27,28,29,30,31,41,44,45,47,48
DB1: EXP2.C6 IC265.3(A2) RN49.15 ; also sheet 12,21,22,24,25,26,27,28,29,30,31,41,44,45,47,48
DB2: EXP2.C7 IC265.4(A3) RN49.14 ; also sheet 12,21,22,24,25,26,27,28,29,30,31,41,44,45,47,48
DB3: EXP2.C8 IC265.5(A4) RN49.13 ; also sheet 12,21,22,24,25,26,27,28,29,30,31,41,44,45,47,48
DB4: EXP2.C9 IC265.6(A5) RN49.12 ; also sheet 12,21,22,24,25,26,27,28,29,30,31,41,44,45,47,48
DB5: EXP2.C10 IC265.7(A6) RN49.11 ; also sheet 12,21,22,24,25,26,27,28,29,30,31,41,44,45,47,48
DB6: EXP2.C11 IC265.8(A7) RN49.10 ; also sheet 12,21,22,24,25,26,27,28,29,30,31,41,44,45,47,48
DB7: EXP2.C12 IC265.9(A8) RN49.9 ; also sheet 12,21,22,24,25,26,27,28,29,30,31,41,44,45,47,48
DB8: EXP2.C21 IC266.9(A8) RN50.9 ; also sheet 12,21,24,26,27,29,30,31,41,44,45,48
DB9: EXP2.C22 IC267.2(A1) RN51.16 ; also sheet 12,24,26,27,29,30,41,44,45,48
DB10: EXP2.C23 IC267.3(A2) RN51.15 ; also sheet 12,24,26,27,29,30,41,44,45,48
DB11: EXP2.C24 IC267.4(A3) RN51.14 ; also sheet 12,24,26,27,29,30,41,44,45,48
DB12: EXP2.C25 IC267.5(A4) RN51.13 ; also sheet 12,24,26,27,29,30,41,44,45,48
DB13: EXP2.C26 IC267.6(A5) RN51.12 ; also sheet 12,24,26,27,29,30,41,44,45,48
DB14: EXP2.C27 IC267.7(A6) RN51.11 ; also sheet 12,24,26,27,29,30,41,44,45,48
DB15: EXP2.C28 IC267.8(A7) RN51.10 ; also sheet 12,24,26,27,29,30,41,44,45,48
GND [low power]: C388.1 C389.1 C390.1 C391.1 C392.1 C393.1 C394.1 C395.1 C396.1 C397.1 C398.- IC258.1(G1) IC258.19(G2) IC259.1(G1) IC259.19(G2) IC260.1(G1) IC260.19(G2) IC261.1(G1) IC261.19(G2) IC262.1(G1) IC262.19(G2) IC263.1(G1) IC263.19(G2) IC264.1(G1) IC264.7(A6) IC264.8(A7) IC264.9(A8) IC264.19(G2) IC265.1(G1) IC265.19(G2) IC266.1(G1) IC266.19(G2) IC267.1(G1) IC267.19(G2) ; also sheet 2,3,4,5,6,7,8,9,10,11,12,13,14,15,16,17,18,19,20,21,22,24,25,26,27,28,29,30,31,32,33,34,35,36,37,38,39,40,41,42,43,44,45,47,48,49
N$1: IC261.18(Y1) RN45.1
N$2: IC258.15(Y4) RN42.4
N$7: IC258.16(Y3) RN42.3
N$8: IC258.17(Y2) RN42.2
N$10: IC267.18(Y1) RN51.1
N$11: IC258.14(Y5) RN42.5
N$12: IC258.13(Y6) RN42.6
N$55: IC258.12(Y7) RN42.7
N$61: IC258.11(Y8) RN42.8
N$67: IC261.17(Y2) RN45.2
N$68: IC261.16(Y3) RN45.3
N$69: IC261.15(Y4) RN45.4
N$77: IC261.14(Y5) RN45.5
N$200: IC261.13(Y6) RN45.6
N$208: IC261.12(Y7) RN45.7
N$209: IC261.11(Y8) RN45.8
N$210: IC265.18(Y1) RN49.1
N$211: IC265.17(Y2) RN49.2
N$212: IC265.16(Y3) RN49.3
N$213: IC265.15(Y4) RN49.4
N$214: IC265.14(Y5) RN49.5
N$215: IC265.13(Y6) RN49.6
N$216: IC265.12(Y7) RN49.7
N$217: IC265.11(Y8) RN49.8
N$218: IC259.18(Y1) RN43.1
N$219: IC259.17(Y2) RN43.2
N$220: IC259.16(Y3) RN43.3
N$221: IC259.15(Y4) RN43.4
N$222: IC259.14(Y5) RN43.5
N$223: IC259.13(Y6) RN43.6
N$224: IC259.12(Y7) RN43.7
N$225: IC259.11(Y8) RN43.8
N$226: IC263.18(Y1) RN47.1
N$227: IC263.17(Y2) RN47.2
N$228: IC263.16(Y3) RN47.3
N$229: IC263.15(Y4) RN47.4
N$230: IC263.14(Y5) RN47.5
N$231: IC263.13(Y6) RN47.6
N$232: IC263.12(Y7) RN47.7
N$233: IC263.11(Y8) RN47.8
N$258: IC260.18(Y1) RN44.1
N$266: IC260.17(Y2) RN44.2
N$267: IC260.16(Y3) RN44.3
N$268: IC260.15(Y4) RN44.4
N$269: IC260.14(Y5) RN44.5
N$270: IC260.13(Y6) RN44.6
N$272: IC260.12(Y7) RN44.7
N$275: IC260.11(Y8) RN44.8
N$276: IC266.18(Y1) RN50.1
N$289: IC266.17(Y2) RN50.2
N$482: IC266.16(Y3) RN50.3
N$521: IC266.15(Y4) RN50.4
N$522: IC266.14(Y5) RN50.5
N$523: IC266.13(Y6) RN50.6
N$524: IC266.12(Y7) RN50.7
N$525: IC266.11(Y8) RN50.8
N$526: IC262.18(Y1) RN46.1
N$528: IC262.17(Y2) RN46.2
N$529: IC262.16(Y3) RN46.3
N$530: IC262.15(Y4) RN46.4
N$534: IC262.14(Y5) RN46.5
N$535: IC262.13(Y6) RN46.6
N$536: IC262.12(Y7) RN46.7
N$537: IC262.11(Y8) RN46.8
N$538: IC264.18(Y1) RN48.1
N$540: IC264.17(Y2) RN48.2
N$848: IC264.16(Y3) RN48.3
N$849: IC264.15(Y4) RN48.4
N$857: IC264.14(Y5) RN48.5
N$861: IC267.17(Y2) RN51.2
N$862: IC267.16(Y3) RN51.3
N$863: IC267.15(Y4) RN51.4
N$864: IC267.14(Y5) RN51.5
N$865: IC267.13(Y6) RN51.6
N$866: IC267.12(Y7) RN51.7
N$867: IC267.11(Y8) RN51.8
N$918: IC258.18(Y1) RN42.1
VCC [low power]: C388.2 C389.2 C390.2 C391.2 C392.2 C393.2 C394.2 C395.2 C396.2 C397.2 C398.+ ; also sheet 2,3,4,6,7,8,9,10,11,12,13,14,15,16,17,18,19,20,21,22,24,25,26,27,28,29,30,31,34,35,36,37,38,39,40,41,42,43,44,45,47,48,49
Unconnected: EXP2.A1 EXP2.A2 EXP2.A3 EXP2.A4 EXP2.A17 EXP2.A31 EXP2.A32 EXP2.B1 EXP2.B2 EXP2.B3 EXP2.B4 EXP2.B31 EXP2.B32 EXP2.C1 EXP2.C2 EXP2.C3 EXP2.C4 EXP2.C17 EXP2.C31 EXP2.C32 IC264.11(Y8) IC264.12(Y7) IC264.13(Y6) RN48.6 RN48.7 RN48.8 RN48.9 RN48.10 RN48.11

### Notes on the sheet
- CFT Mini-Computer
- Bus Hold
- PCB @ (0, 1.95)
- Decoupling
- @ (.175, 3.675)
- @ (5.8, 3.675)
- @ (5.8, .225)
- U
- @ (.175, .225)

## Sheet 47 of 49
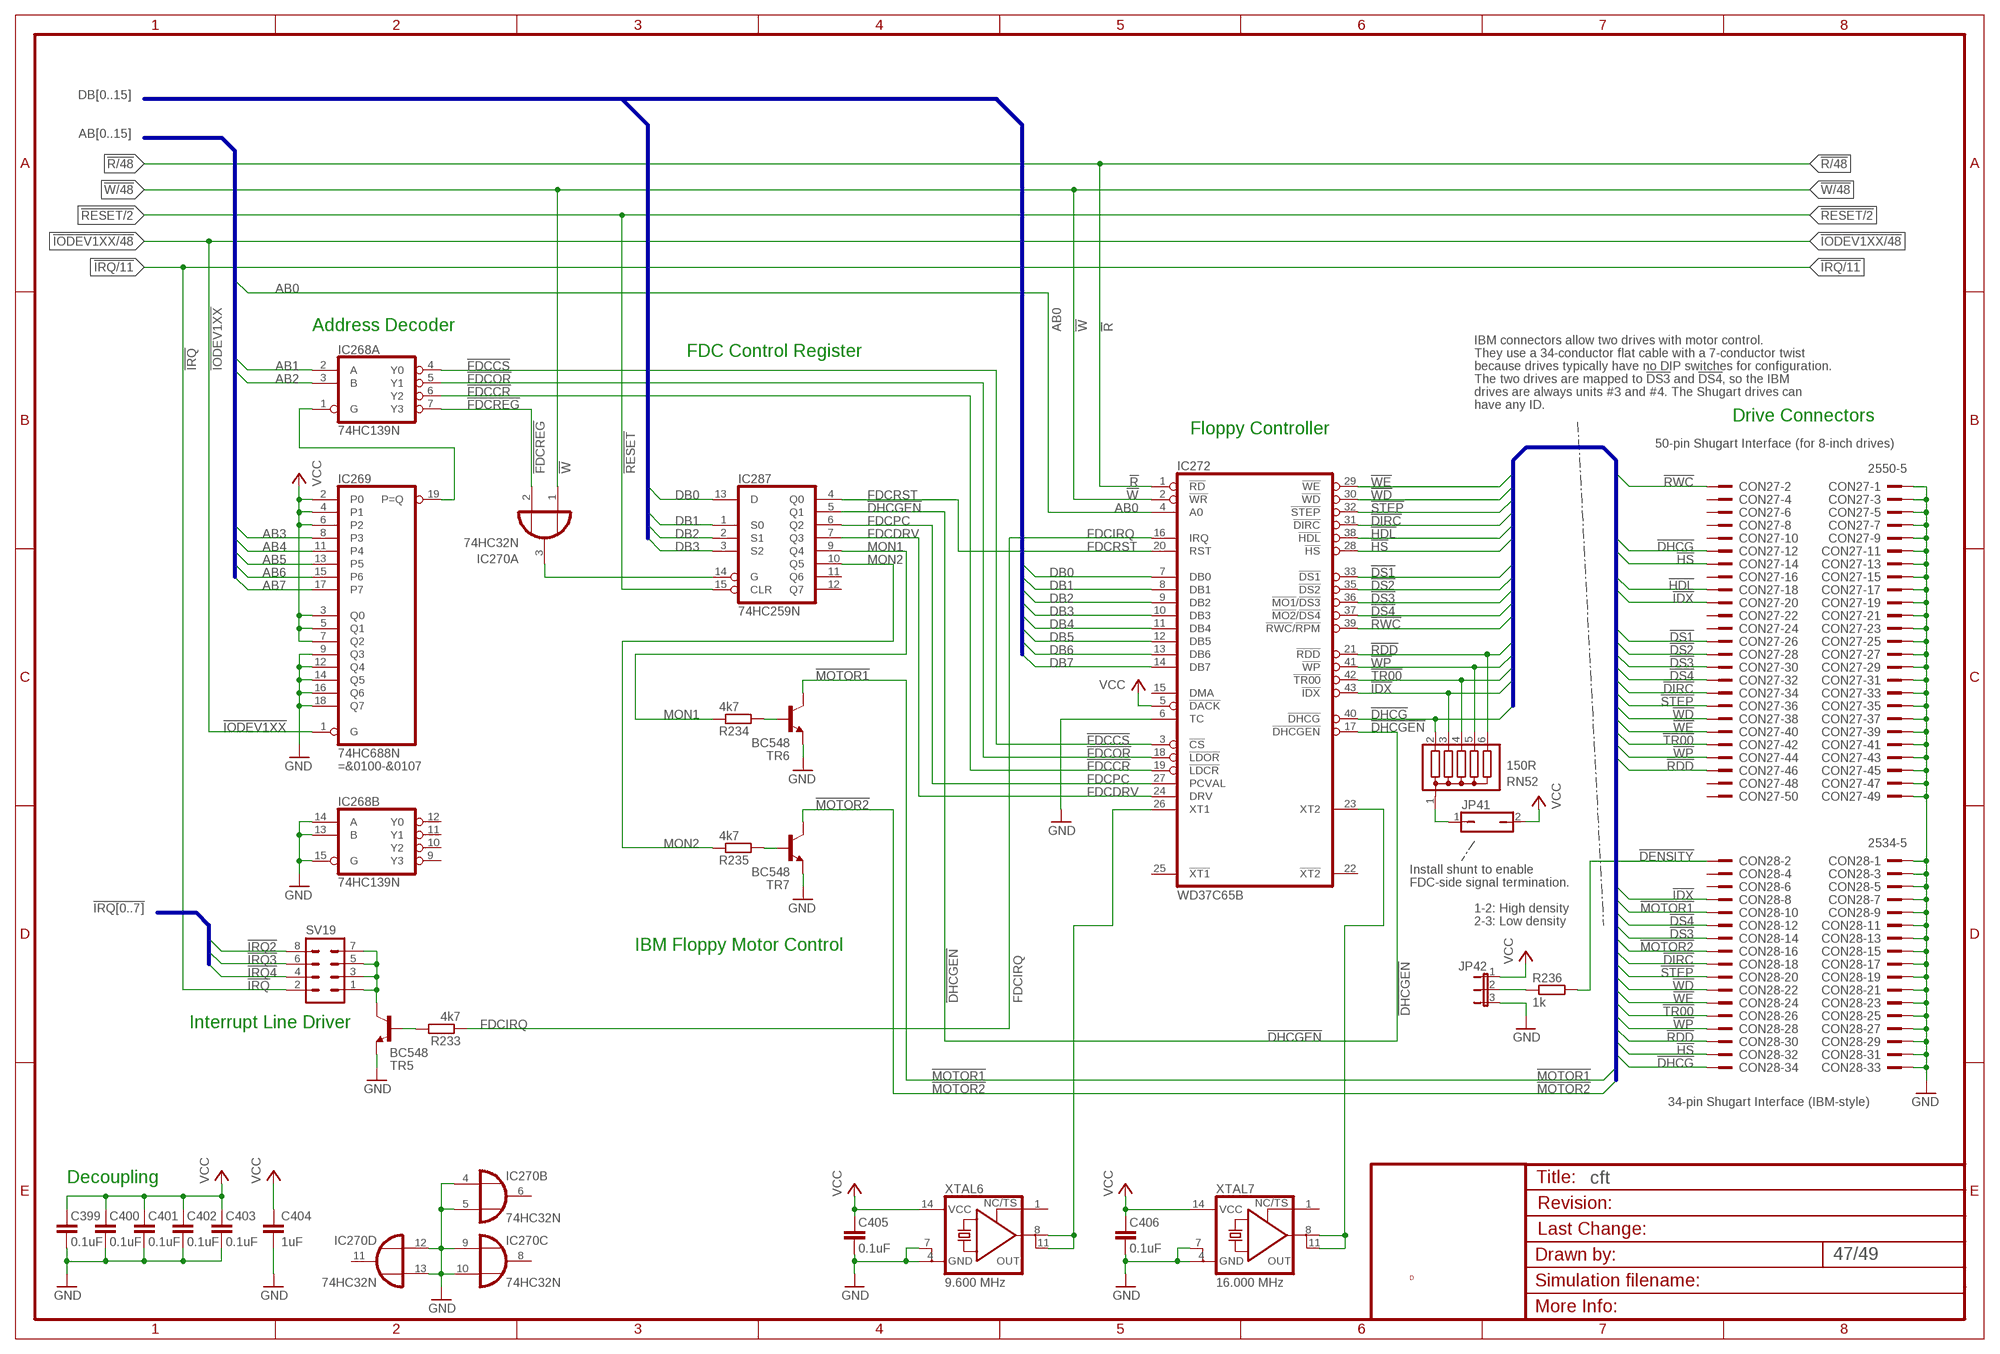
[diagram p46: schematic, sheet 47]

### Parts
C399  0.1uF  C-EU025-024X044  [C025-024X044]
C400  0.1uF  C-EU025-024X044  [C025-024X044]
C401  0.1uF  C-EU025-024X044  [C025-024X044]
C402  0.1uF  C-EU025-024X044  [C025-024X044]
C403  0.1uF  C-EU025-024X044  [C025-024X044]
C404  1uF  C-EU025-024X044  [C025-024X044]
C405  0.1uF  C-EU025-024X044  [C025-024X044]
C406  0.1uF  C-EU025-024X044  [C025-024X044]
CON27  2550-5  [PAK100/2500-5-50]
CON28  2534-5  [PAK100/2500-5-34]
IC268  74HC139N  [DIL16]
IC269  74HC688N  [DIL20]
IC270  74HC32N  [DIL14]
IC272  WD37C65B  [PLCC-S44-SOCKET]
IC287  74HC259N  [DIL16]
JP41  JP1Q  [JP1]
JP42  JP2E  [JP2]
R233  4k7  R-EU_0204/7  [0204/7]
R234  4k7  R-EU_0204/7  [0204/7]
R235  4k7  R-EU_0204/7  [0204/7]
R236  1k  R-EU_0204/7  [0204/7]
RN52  150R  G05R  [SIL6]
SV19  MA04-2  [MA04-2]
TR5  BC548  [TO92-EBC]
TR6  BC548  [TO92-EBC]
TR7  BC548  [TO92-EBC]
XTAL6  9.600 MHz  XO2-08-14-SOCKET  [DIL0814S]
XTAL7  16.000 MHz  XO2-08-14-SOCKET  [DIL0814S]

### Nets
!DENSITY: CON28.2 R236.2
!DHCG: CON27.12 CON28.34 IC272.40(!DHCG) RN52.2
!DHCGEN: IC272.17(!DHCGEN) IC287.5(Q1)
!DIRC: CON27.34 CON28.18 IC272.31(!DIRC)
!DS1: CON27.26 IC272.33(!DS1)
!DS2: CON27.28 IC272.35(!DS2)
!DS3: CON27.30 CON28.14 IC272.36(!MO1!/!DS3)
!DS4: CON27.32 CON28.12 IC272.37(!MO2!/!DS4)
!FDCCR: IC268.6(A:Y2) IC272.19(!LDCR)
!FDCCS: IC268.4(A:Y0) IC272.3(!CS)
!FDCOR: IC268.5(A:Y1) IC272.18(!LDOR)
!FDCREG: IC268.7(A:Y3) IC270.2(A:I1)
!FDCSEL: IC268.1(A:G) IC269.19(P=Q)
!HDL: CON27.18 IC272.38(!HDL)
!HS: CON27.14 CON28.32 IC272.28(!HS)
!IDX: CON27.20 CON28.8 IC272.43(!IDX) RN52.3
!IODEV1XX: IC269.1(G) ; also sheet 13,44,45,46,48
!IRQ: SV19.2 ; also sheet 11,22,25,26,27,28,29,30,44
!IRQ2: SV19.8 ; also sheet 22,25,27,29,30,44,45,46
!IRQ3: SV19.6 ; also sheet 22,25,29,30,44,45,46
!IRQ4: SV19.4 ; also sheet 22,25,29,30,44,45,46
!MOTOR1: CON28.10 TR6.C
!MOTOR2: CON28.16 TR7.C
!R: IC272.1(!RD) ; also sheet 4,5,6,12,22,24,25,26,27,28,29,30,41,42,44,45,46,48
!RDD: CON27.46 CON28.30 IC272.21(!RDD) RN52.6
!RESET: IC287.15(CLR) ; also sheet 2,3,4,7,8,10,11,12,13,14,17,18,19,20,21,22,25,26,28,29,30,31,44,45,46
!RWC: CON27.2 IC272.39(!RWC!/!RPM!)
!STEP: CON27.36 CON28.20 IC272.32(!STEP)
!TR00: CON27.42 CON28.26 IC272.42(!TR00) RN52.4
!W: IC270.1(A:I0) IC272.2(!WR) ; also sheet 12,21,22,24,25,26,27,28,29,30,41,44,45,46,48
!WD: CON27.38 CON28.22 IC272.30(!WD)
!WE: CON27.40 CON28.24 IC272.29(!WE)
!WP: CON27.44 CON28.28 IC272.41(!WP) RN52.5
AB0: IC272.4(A0) ; also sheet 13,21,24,25,26,27,28,29,30,41,44,45,46,48
AB1: IC268.2(A:A) ; also sheet 13,21,24,25,26,27,28,29,30,41,44,45,46,48
AB2: IC268.3(A:B) ; also sheet 13,21,24,25,26,27,29,30,41,44,45,46,48
AB3: IC269.8(P3) ; also sheet 13,24,25,26,27,28,29,30,41,44,45,46,48
AB4: IC269.11(P4) ; also sheet 13,22,24,25,26,27,28,29,30,41,44,45,46,48
AB5: IC269.13(P5) ; also sheet 13,21,22,24,25,26,27,28,29,30,41,44,45,46,48
AB6: IC269.15(P6) ; also sheet 13,21,22,24,25,26,27,28,29,30,41,44,45,46,48
AB7: IC269.17(P7) ; also sheet 13,21,22,24,25,26,27,28,29,30,41,44,45,46,48
DB0: IC272.7(DB0) IC287.13(D) ; also sheet 12,21,22,24,25,26,27,28,29,30,31,41,44,45,46,48
DB1: IC272.8(DB1) IC287.1(S0) ; also sheet 12,21,22,24,25,26,27,28,29,30,31,41,44,45,46,48
DB2: IC272.9(DB2) IC287.2(S1) ; also sheet 12,21,22,24,25,26,27,28,29,30,31,41,44,45,46,48
DB3: IC272.10(DB3) IC287.3(S2) ; also sheet 12,21,22,24,25,26,27,28,29,30,31,41,44,45,46,48
DB4: IC272.11(DB4) ; also sheet 12,21,22,24,25,26,27,28,29,30,31,41,44,45,46,48
DB5: IC272.12(DB5) ; also sheet 12,21,22,24,25,26,27,28,29,30,31,41,44,45,46,48
DB6: IC272.13(DB6) ; also sheet 12,21,22,24,25,26,27,28,29,30,31,41,44,45,46,48
DB7: IC272.14(DB7) ; also sheet 12,21,22,24,25,26,27,28,29,30,31,41,44,45,46,48
FDCDRV: IC272.24(DRV) IC287.7(Q3)
FDCIRQ: IC272.16(IRQ) R233.1
FDCPC: IC272.27(PCVAL) IC287.6(Q2)
FDCRST: IC272.20(RST) IC287.4(Q0)
GND [low power]: C399.1 C400.1 C401.1 C402.1 C403.1 C404.2 C405.1 C406.1 CON27.1 CON27.3 CON27.5 CON27.7 CON27.9 CON27.11 CON27.13 CON27.15 CON27.17 CON27.19 CON27.21 CON27.23 CON27.25 CON27.27 CON27.29 CON27.31 CON27.33 CON27.35 CON27.37 CON27.39 CON27.41 CON27.43 CON27.45 CON27.47 CON27.49 CON28.1 CON28.3 CON28.5 CON28.7 CON28.9 CON28.11 CON28.13 CON28.15 CON28.17 CON28.19 CON28.21 CON28.23 CON28.25 CON28.27 CON28.29 CON28.31 CON28.33 IC268.13(B:B) IC268.14(B:A) IC268.15(B:G) IC269.9(Q3) IC269.12(Q4) IC269.14(Q5) IC269.16(Q6) IC269.18(Q7) IC270.4(B:I0) IC270.5(B:I1) IC270.9(C:I0) IC270.10(C:I1) IC270.12(D:I0) IC270.13(D:I1) IC272.6(TC) JP42.3 TR5.E TR6.E TR7.E XTAL6.4(GND) XTAL6.7(GND1) XTAL7.4(GND) XTAL7.7(GND1) ; also sheet 2,3,4,5,6,7,8,9,10,11,12,13,14,15,16,17,18,19,20,21,22,24,25,26,27,28,29,30,31,32,33,34,35,36,37,38,39,40,41,42,43,44,45,46,48,49
MON1: IC287.9(Q4) R234.1
MON2: IC287.10(Q5) R235.1
N$15: IC270.3(A:O) IC287.14(G)
N$53: IC272.26(XT1) XTAL6.8(OUT) XTAL6.11(OUT1)
N$54: IC272.23(XT2) XTAL7.8(OUT) XTAL7.11(OUT1)
N$72: JP41.1 RN52.1
N$73: JP42.2 R236.1
N$74: SV19.1 SV19.3 SV19.5 SV19.7 TR5.C
N$75: R233.2 TR5.B
N$76: R234.2 TR6.B
N$78: R235.2 TR7.B
VCC [low power]: C399.2 C400.2 C401.2 C402.2 C403.2 C404.1 C405.2 C406.2 IC269.2(P0) IC269.3(Q0) IC269.4(P1) IC269.5(Q1) IC269.6(P2) IC269.7(Q2) IC272.5(!DACK) JP41.2 JP42.1 XTAL6.14(VCC) XTAL7.14(VCC) ; also sheet 2,3,4,6,7,8,9,10,11,12,13,14,15,16,17,18,19,20,21,22,24,25,26,27,28,29,30,31,34,35,36,37,38,39,40,41,42,43,44,45,46,48,49
Unconnected: CON27.4 CON27.6 CON27.8 CON27.10 CON27.16 CON27.22 CON27.24 CON27.48 CON27.50 CON28.4 CON28.6 IC268.9(B:Y3) IC268.10(B:Y2) IC268.11(B:Y1) IC268.12(B:Y0) IC270.6(B:O) IC270.8(C:O) IC270.11(D:O) IC272.15(DMA) IC272.22(!XT2) IC272.25(!XT1) IC287.11(Q6) IC287.12(Q7) XTAL6.1(TS) XTAL7.1(TS)

### Buses
DB[0..15]
AB[0..15]
!IRQ[0..7]
!WE,!WD,!STEP,!DIRC,!HDL,!HS,!DS[1..4],!RWC,!RDD,!WP,!TR00,!IDX,!DHCG,!MOTOR[1..2]

### Notes on the sheet
- Address Decoder
- IBM connectors allow two drives with motor control.
- FDC Control Register | They use a 34-conductor flat cable with a 7-conductor twist
- because drives typically have no DIP switches for configuration.
- The two drives are mapped to !DS3! and !DS4!, so the IBM
- drives are always units #3 and #4. The Shugart drives can
- have any ID.
- Drive Connectors
- Floppy Controller
- 50-pin Shugart Interface (for 8-inch drives)
- =&0100-&0107
- Install shunt to enable
- FDC-side signal termination.
- 1-2: High density
- 2-3: Low density
- IBM Floppy Motor Control
- Interrupt Line Driver
- 34-pin Shugart Interface (IBM-style)
- Decoupling
- D

## Sheet 48 of 49
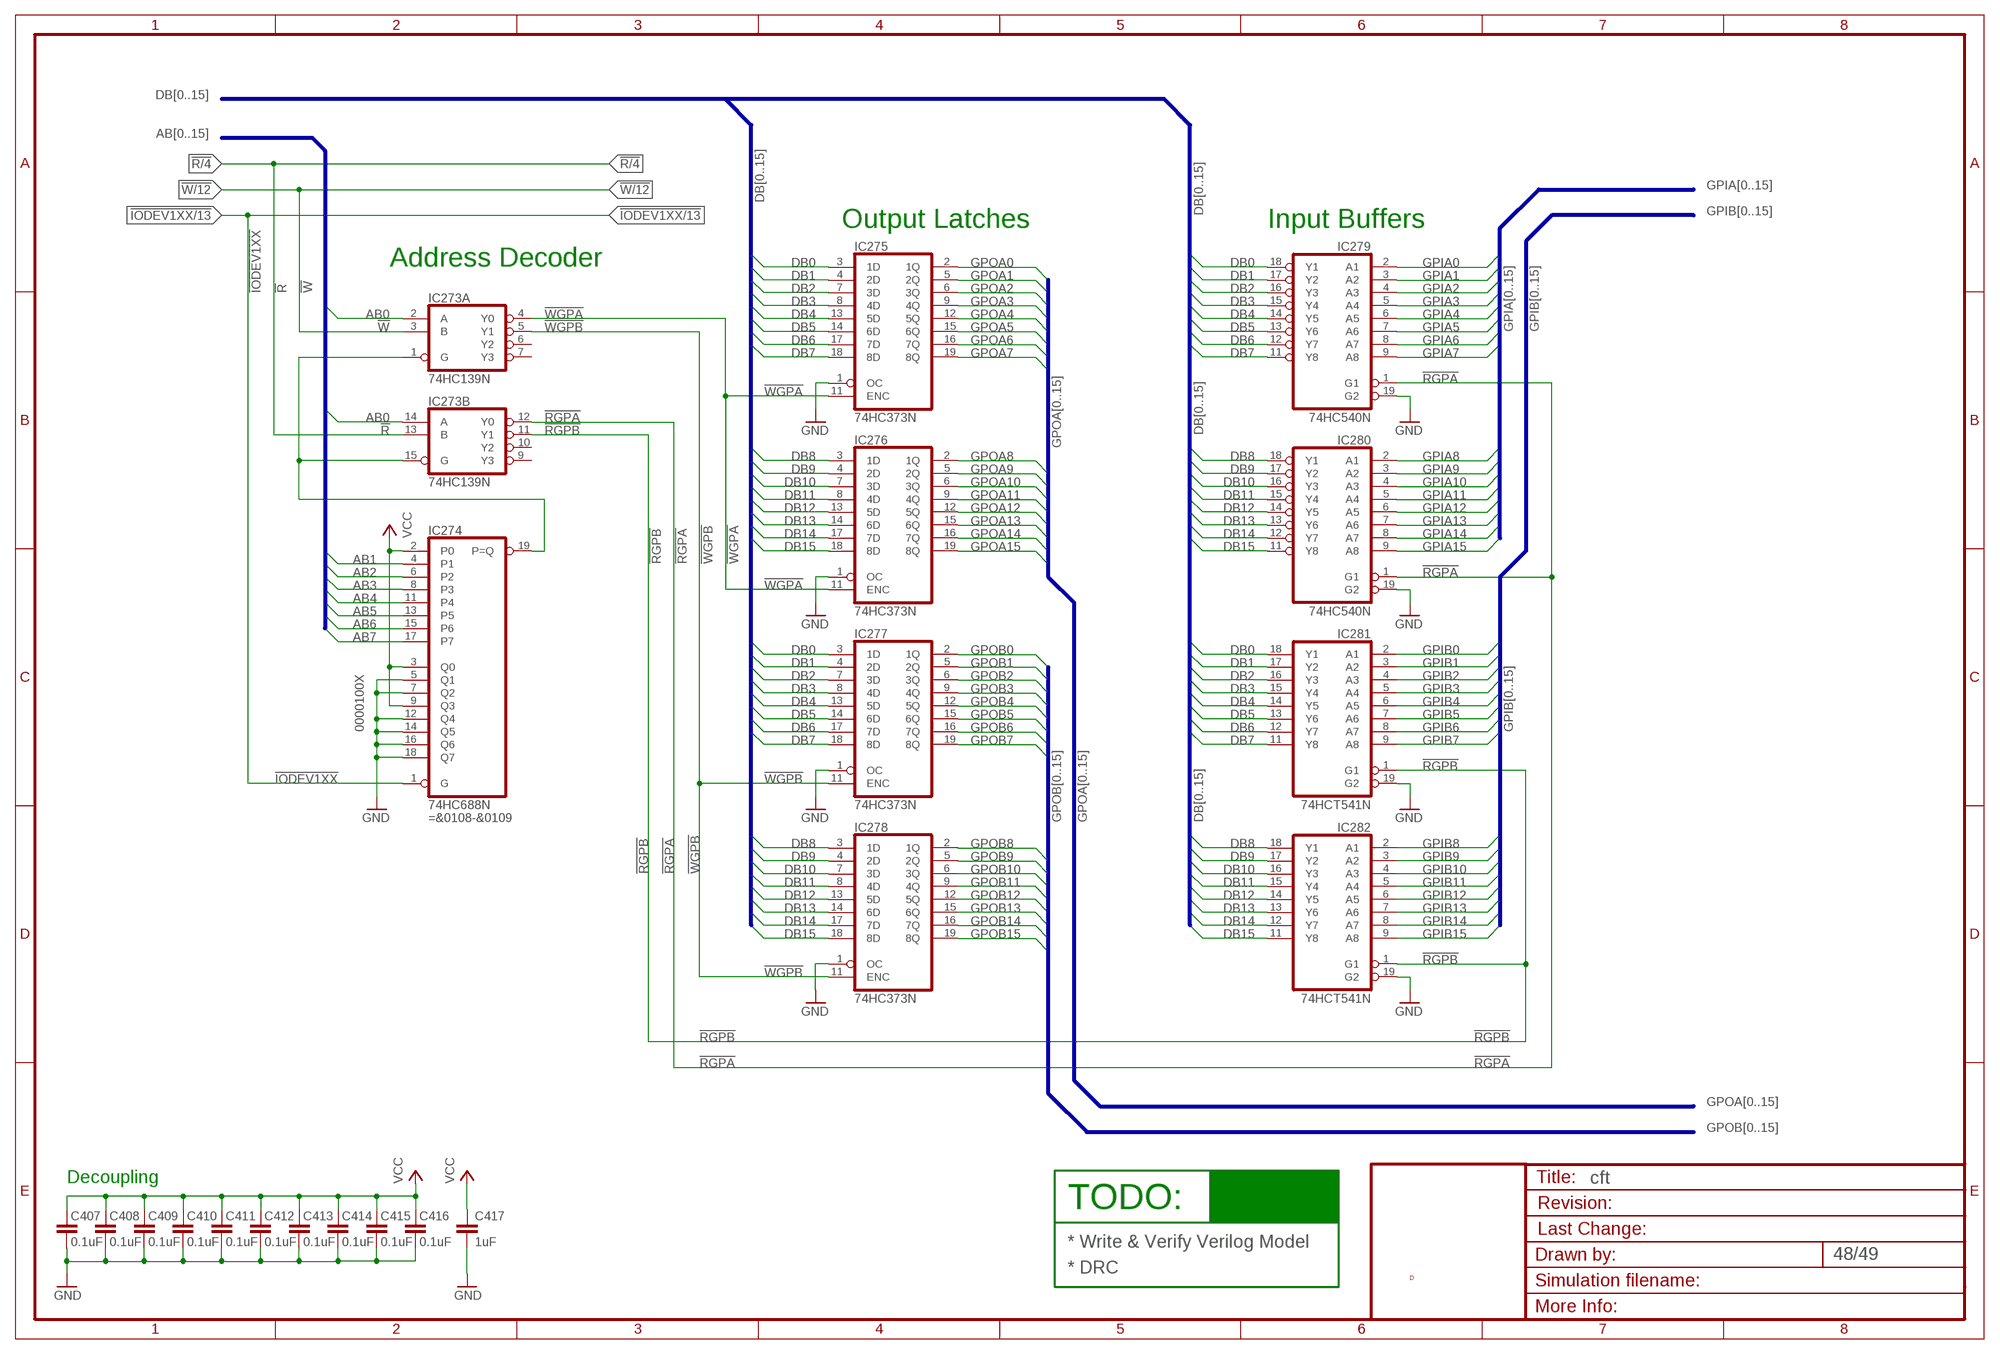
[diagram p47: schematic, sheet 48]

### Parts
C407  0.1uF  C-EU025-024X044  [C025-024X044]
C408  0.1uF  C-EU025-024X044  [C025-024X044]
C409  0.1uF  C-EU025-024X044  [C025-024X044]
C410  0.1uF  C-EU025-024X044  [C025-024X044]
C411  0.1uF  C-EU025-024X044  [C025-024X044]
C412  0.1uF  C-EU025-024X044  [C025-024X044]
C413  0.1uF  C-EU025-024X044  [C025-024X044]
C414  0.1uF  C-EU025-024X044  [C025-024X044]
C415  0.1uF  C-EU025-024X044  [C025-024X044]
C416  0.1uF  C-EU025-024X044  [C025-024X044]
C417  1uF  C-EU025-024X044  [C025-024X044]
IC273  74HC139N  [DIL16]
IC274  74HC688N  [DIL20]
IC275  74HC373N  [DIL20]
IC276  74HC373N  [DIL20]
IC277  74HC373N  [DIL20]
IC278  74HC373N  [DIL20]
IC279  74HC540N  [DIL20]
IC280  74HC540N  [DIL20]
IC281  74HCT541N  [DIL20]
IC282  74HCT541N  [DIL20]

### Nets
!IODEV1XX: IC274.1(G) ; also sheet 13,44,45,46,47
!R: IC273.13(B:B) ; also sheet 4,5,6,12,22,24,25,26,27,28,29,30,41,42,44,45,46,47
!RGPA: IC273.12(B:Y0) IC279.1(G1) IC280.1(G1)
!RGPB: IC273.11(B:Y1) IC281.1(G1) IC282.1(G1)
!W: IC273.3(A:B) ; also sheet 12,21,22,24,25,26,27,28,29,30,41,44,45,46,47
!WGPA: IC273.4(A:Y0) IC275.11(ENC) IC276.11(ENC)
!WGPB: IC273.5(A:Y1) IC277.11(ENC) IC278.11(ENC)
AB0: IC273.2(A:A) IC273.14(B:A) ; also sheet 13,21,24,25,26,27,28,29,30,41,44,45,46,47
AB1: IC274.4(P1) ; also sheet 13,21,24,25,26,27,28,29,30,41,44,45,46,47
AB2: IC274.6(P2) ; also sheet 13,21,24,25,26,27,29,30,41,44,45,46,47
AB3: IC274.8(P3) ; also sheet 13,24,25,26,27,28,29,30,41,44,45,46,47
AB4: IC274.11(P4) ; also sheet 13,22,24,25,26,27,28,29,30,41,44,45,46,47
AB5: IC274.13(P5) ; also sheet 13,21,22,24,25,26,27,28,29,30,41,44,45,46,47
AB6: IC274.15(P6) ; also sheet 13,21,22,24,25,26,27,28,29,30,41,44,45,46,47
AB7: IC274.17(P7) ; also sheet 13,21,22,24,25,26,27,28,29,30,41,44,45,46,47
DB0: IC275.3(1D) IC277.3(1D) IC279.18(Y1) IC281.18(Y1) ; also sheet 12,21,22,24,25,26,27,28,29,30,31,41,44,45,46,47
DB1: IC275.4(2D) IC277.4(2D) IC279.17(Y2) IC281.17(Y2) ; also sheet 12,21,22,24,25,26,27,28,29,30,31,41,44,45,46,47
DB2: IC275.7(3D) IC277.7(3D) IC279.16(Y3) IC281.16(Y3) ; also sheet 12,21,22,24,25,26,27,28,29,30,31,41,44,45,46,47
DB3: IC275.8(4D) IC277.8(4D) IC279.15(Y4) IC281.15(Y4) ; also sheet 12,21,22,24,25,26,27,28,29,30,31,41,44,45,46,47
DB4: IC275.13(5D) IC277.13(5D) IC279.14(Y5) IC281.14(Y5) ; also sheet 12,21,22,24,25,26,27,28,29,30,31,41,44,45,46,47
DB5: IC275.14(6D) IC277.14(6D) IC279.13(Y6) IC281.13(Y6) ; also sheet 12,21,22,24,25,26,27,28,29,30,31,41,44,45,46,47
DB6: IC275.17(7D) IC277.17(7D) IC279.12(Y7) IC281.12(Y7) ; also sheet 12,21,22,24,25,26,27,28,29,30,31,41,44,45,46,47
DB7: IC275.18(8D) IC277.18(8D) IC279.11(Y8) IC281.11(Y8) ; also sheet 12,21,22,24,25,26,27,28,29,30,31,41,44,45,46,47
DB8: IC276.3(1D) IC278.3(1D) IC280.18(Y1) IC282.18(Y1) ; also sheet 12,21,24,26,27,29,30,31,41,44,45,46
DB9: IC276.4(2D) IC278.4(2D) IC280.17(Y2) IC282.17(Y2) ; also sheet 12,24,26,27,29,30,41,44,45,46
DB10: IC276.7(3D) IC278.7(3D) IC280.16(Y3) IC282.16(Y3) ; also sheet 12,24,26,27,29,30,41,44,45,46
DB11: IC276.8(4D) IC278.8(4D) IC280.15(Y4) IC282.15(Y4) ; also sheet 12,24,26,27,29,30,41,44,45,46
DB12: IC276.13(5D) IC278.13(5D) IC280.14(Y5) IC282.14(Y5) ; also sheet 12,24,26,27,29,30,41,44,45,46
DB13: IC276.14(6D) IC278.14(6D) IC280.13(Y6) IC282.13(Y6) ; also sheet 12,24,26,27,29,30,41,44,45,46
DB14: IC276.17(7D) IC278.17(7D) IC280.12(Y7) IC282.12(Y7) ; also sheet 12,24,26,27,29,30,41,44,45,46
DB15: IC276.18(8D) IC278.18(8D) IC280.11(Y8) IC282.11(Y8) ; also sheet 12,24,26,27,29,30,41,44,45,46
GND [low power]: C407.1 C408.1 C409.1 C410.1 C411.1 C412.1 C413.1 C414.1 C415.1 C416.1 C417.2 IC274.5(Q1) IC274.7(Q2) IC274.12(Q4) IC274.14(Q5) IC274.16(Q6) IC274.18(Q7) IC275.1(OC) IC276.1(OC) IC277.1(OC) IC278.1(OC) IC279.19(G2) IC280.19(G2) IC281.19(G2) IC282.19(G2) ; also sheet 2,3,4,5,6,7,8,9,10,11,12,13,14,15,16,17,18,19,20,21,22,24,25,26,27,28,29,30,31,32,33,34,35,36,37,38,39,40,41,42,43,44,45,46,47,49
GPIA0: IC279.2(A1) ; also sheet 49
GPIA1: IC279.3(A2) ; also sheet 49
GPIA2: IC279.4(A3) ; also sheet 49
GPIA3: IC279.5(A4) ; also sheet 49
GPIA4: IC279.6(A5) ; also sheet 49
GPIA5: IC279.7(A6) ; also sheet 49
GPIA6: IC279.8(A7) ; also sheet 49
GPIA7: IC279.9(A8) ; also sheet 49
GPIA8: IC280.2(A1) ; also sheet 49
GPIA9: IC280.3(A2) ; also sheet 49
GPIA10: IC280.4(A3) ; also sheet 49
GPIA11: IC280.5(A4) ; also sheet 49
GPIA12: IC280.6(A5) ; also sheet 49
GPIA13: IC280.7(A6) ; also sheet 49
GPIA14: IC280.8(A7) ; also sheet 49
GPIA15: IC280.9(A8) ; also sheet 49
GPIB0: IC281.2(A1) ; also sheet 49
GPIB1: IC281.3(A2) ; also sheet 49
GPIB2: IC281.4(A3) ; also sheet 49
GPIB3: IC281.5(A4) ; also sheet 49
GPIB4: IC281.6(A5) ; also sheet 49
GPIB5: IC281.7(A6) ; also sheet 49
GPIB6: IC281.8(A7) ; also sheet 49
GPIB7: IC281.9(A8) ; also sheet 49
GPIB8: IC282.2(A1) ; also sheet 49
GPIB9: IC282.3(A2) ; also sheet 49
GPIB10: IC282.4(A3) ; also sheet 49
GPIB11: IC282.5(A4) ; also sheet 49
GPIB12: IC282.6(A5) ; also sheet 49
GPIB13: IC282.7(A6) ; also sheet 49
GPIB14: IC282.8(A7) ; also sheet 49
GPIB15: IC282.9(A8) ; also sheet 49
GPOA0: IC275.2(1Q) ; also sheet 49
GPOA1: IC275.5(2Q) ; also sheet 49
GPOA2: IC275.6(3Q) ; also sheet 49
GPOA3: IC275.9(4Q) ; also sheet 49
GPOA4: IC275.12(5Q) ; also sheet 49
GPOA5: IC275.15(6Q) ; also sheet 49
GPOA6: IC275.16(7Q) ; also sheet 49
GPOA7: IC275.19(8Q) ; also sheet 49
GPOA8: IC276.2(1Q) ; also sheet 49
GPOA9: IC276.5(2Q) ; also sheet 49
GPOA10: IC276.6(3Q) ; also sheet 49
GPOA11: IC276.9(4Q) ; also sheet 49
GPOA12: IC276.12(5Q) ; also sheet 49
GPOA13: IC276.15(6Q) ; also sheet 49
GPOA14: IC276.16(7Q) ; also sheet 49
GPOA15: IC276.19(8Q) ; also sheet 49
GPOB0: IC277.2(1Q) ; also sheet 49
GPOB1: IC277.5(2Q) ; also sheet 49
GPOB2: IC277.6(3Q) ; also sheet 49
GPOB3: IC277.9(4Q) ; also sheet 49
GPOB4: IC277.12(5Q) ; also sheet 49
GPOB5: IC277.15(6Q) ; also sheet 49
GPOB6: IC277.16(7Q) ; also sheet 49
GPOB7: IC277.19(8Q) ; also sheet 49
GPOB8: IC278.2(1Q) ; also sheet 49
GPOB9: IC278.5(2Q) ; also sheet 49
GPOB10: IC278.6(3Q) ; also sheet 49
GPOB11: IC278.9(4Q) ; also sheet 49
GPOB12: IC278.12(5Q) ; also sheet 49
GPOB13: IC278.15(6Q) ; also sheet 49
GPOB14: IC278.16(7Q) ; also sheet 49
GPOB15: IC278.19(8Q) ; also sheet 49
N$96: IC273.1(A:G) IC273.15(B:G) IC274.19(P=Q)
VCC [low power]: C407.2 C408.2 C409.2 C410.2 C411.2 C412.2 C413.2 C414.2 C415.2 C416.2 C417.1 IC274.2(P0) IC274.3(Q0) IC274.9(Q3) ; also sheet 2,3,4,6,7,8,9,10,11,12,13,14,15,16,17,18,19,20,21,22,24,25,26,27,28,29,30,31,34,35,36,37,38,39,40,41,42,43,44,45,46,47,49
Unconnected: IC273.6(A:Y2) IC273.7(A:Y3) IC273.9(B:Y3) IC273.10(B:Y2)

### Buses
DB[0..15]
AB[0..15]
GPOA[0..15]
GPIA[0..15]
GPIB[0..15]
GPOB[0..15]

### Notes on the sheet
- Output Latches | Input Buffers
- Address Decoder
- 0000100X
- =&0108-&0109
- Decoupling
- TODO:
- * Write & Verify Verilog Model
- * DRC
- D

## Sheet 49 of 49
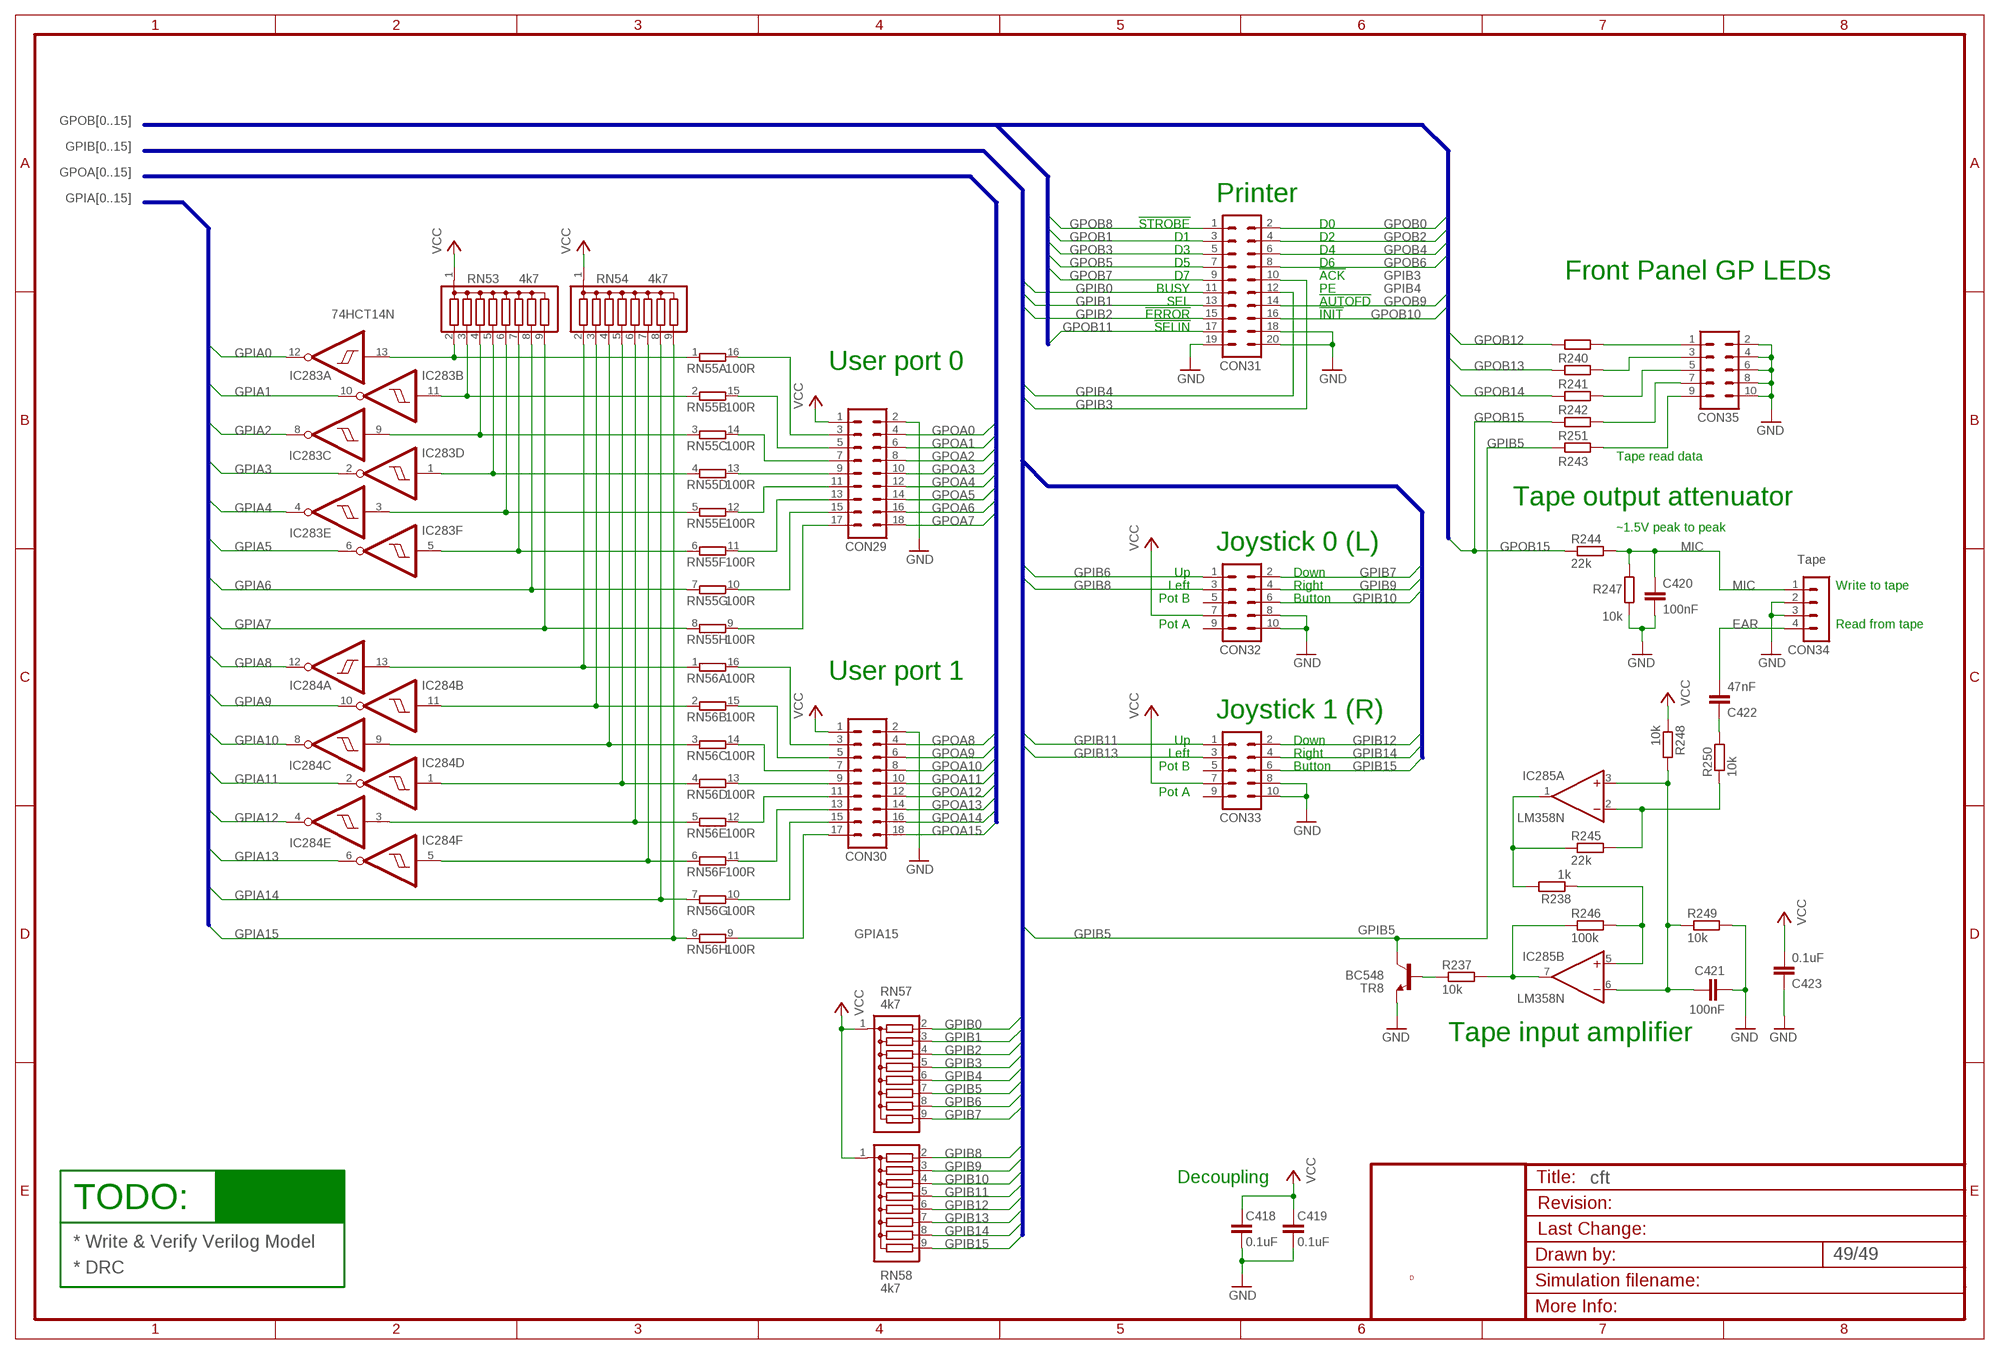
[diagram p48: schematic, sheet 49]

### Parts
C418  0.1uF  C-EU025-024X044  [C025-024X044]
C419  0.1uF  C-EU025-024X044  [C025-024X044]
C420  100nF  C-EU025-024X044  [C025-024X044]
C421  100nF  C-EU025-024X044  [C025-024X044]
C422  47nF  C-EU025-024X044  [C025-024X044]
C423  0.1uF  C-EU025-024X044  [C025-024X044]
CON29  MA09-2  [MA09-2]
CON30  MA09-2  [MA09-2]
CON31  MA10-2  [MA10-2]
CON32  MA05-2  [MA05-2]
CON33  MA05-2  [MA05-2]
CON34  MA04-1  [MA04-1]
CON35  MA05-2  [MA05-2]
IC283  74HCT14N  [DIL14]
IC284  74HCT14N  [DIL14]
IC285  LM358N  [DIL08]
R237  10k  R-EU_0207/7  [0207/7]
R238  1k  R-EU_0207/7  [0207/7]
R240  330R  R-EU_0204/7  [0204/7]
R241  330R  R-EU_0204/7  [0204/7]
R242  330R  R-EU_0204/7  [0204/7]
R243  330R  R-EU_0204/7  [0204/7]
R244  22k  R-EU_0207/7  [0207/7]
R245  22k  R-EU_0207/7  [0207/7]
R246  100k  R-EU_0207/7  [0207/7]
R247  10k  R-EU_0207/7  [0207/7]
R248  10k  R-EU_0207/7  [0207/7]
R249  10k  R-EU_0207/7  [0207/7]
R250  10k  R-EU_0207/7  [0207/7]
R251  330R  R-EU_0204/7  [0204/7]
RN53  4k7  G08R  [SIL9]
RN54  4k7  G08R  [SIL9]
RN55  100R  8R-N  [DIL16]
RN56  100R  8R-N  [DIL16]
RN57  4k7  G08R  [SIL9]
RN58  4k7  G08R  [SIL9]
TR8  BC548  [TO92-EBC]

### Nets
EAR: C422.2 CON34.4
GND [low power]: C418.1 C419.1 C420.2 C421.2 C423.1 CON29.2 CON30.2 CON31.18 CON31.19 CON31.20 CON32.8 CON32.10 CON33.8 CON33.10 CON34.2 CON34.3 CON35.2 CON35.4 CON35.6 CON35.8 CON35.10 R247.2 R249.2 TR8.E ; also sheet 2,3,4,5,6,7,8,9,10,11,12,13,14,15,16,17,18,19,20,21,22,24,25,26,27,28,29,30,31,32,33,34,35,36,37,38,39,40,41,42,43,44,45,46,47,48
GPIA0: IC283.12(A:O) ; also sheet 48
GPIA1: IC283.10(B:O) ; also sheet 48
GPIA2: IC283.8(C:O) ; also sheet 48
GPIA3: IC283.2(D:O) ; also sheet 48
GPIA4: IC283.4(E:O) ; also sheet 48
GPIA5: IC283.6(F:O) ; also sheet 48
GPIA6: RN53.8 RN55.7 ; also sheet 48
GPIA7: RN53.9 RN55.8 ; also sheet 48
GPIA8: IC284.12(A:O) ; also sheet 48
GPIA9: IC284.10(B:O) ; also sheet 48
GPIA10: IC284.8(C:O) ; also sheet 48
GPIA11: IC284.2(D:O) ; also sheet 48
GPIA12: IC284.4(E:O) ; also sheet 48
GPIA13: IC284.6(F:O) ; also sheet 48
GPIA14: RN54.8 RN56.7 ; also sheet 48
GPIA15: RN54.9 RN56.8 ; also sheet 48
GPIB0: CON31.11 RN57.2 ; also sheet 48
GPIB1: CON31.13 RN57.3 ; also sheet 48
GPIB2: CON31.15 RN57.4 ; also sheet 48
GPIB3: CON31.10 RN57.5 ; also sheet 48
GPIB4: CON31.12 RN57.6 ; also sheet 48
GPIB5: R243.1 RN57.7 TR8.C ; also sheet 48
GPIB6: CON32.1 RN57.8 ; also sheet 48
GPIB7: CON32.2 RN57.9 ; also sheet 48
GPIB8: CON32.3 RN58.2 ; also sheet 48
GPIB9: CON32.4 RN58.3 ; also sheet 48
GPIB10: CON32.6 RN58.4 ; also sheet 48
GPIB11: CON33.1 RN58.5 ; also sheet 48
GPIB12: CON33.2 RN58.6 ; also sheet 48
GPIB13: CON33.3 RN58.7 ; also sheet 48
GPIB14: CON33.4 RN58.8 ; also sheet 48
GPIB15: CON33.6 RN58.9 ; also sheet 48
GPOA0: CON29.4 ; also sheet 48
GPOA1: CON29.6 ; also sheet 48
GPOA2: CON29.8 ; also sheet 48
GPOA3: CON29.10 ; also sheet 48
GPOA4: CON29.12 ; also sheet 48
GPOA5: CON29.14 ; also sheet 48
GPOA6: CON29.16 ; also sheet 48
GPOA7: CON29.18 ; also sheet 48
GPOA8: CON30.4 ; also sheet 48
GPOA9: CON30.6 ; also sheet 48
GPOA10: CON30.8 ; also sheet 48
GPOA11: CON30.10 ; also sheet 48
GPOA12: CON30.12 ; also sheet 48
GPOA13: CON30.14 ; also sheet 48
GPOA14: CON30.16 ; also sheet 48
GPOA15: CON30.18 ; also sheet 48
GPOB0: CON31.2 ; also sheet 48
GPOB1: CON31.3 ; also sheet 48
GPOB2: CON31.4 ; also sheet 48
GPOB3: CON31.5 ; also sheet 48
GPOB4: CON31.6 ; also sheet 48
GPOB5: CON31.7 ; also sheet 48
GPOB6: CON31.8 ; also sheet 48
GPOB7: CON31.9 ; also sheet 48
GPOB8: CON31.1 ; also sheet 48
GPOB9: CON31.14 ; also sheet 48
GPOB10: CON31.16 ; also sheet 48
GPOB11: CON31.17 ; also sheet 48
GPOB12: R240.1 ; also sheet 48
GPOB13: R241.1 ; also sheet 48
GPOB14: R242.1 ; also sheet 48
GPOB15: R244.1 R251.1 ; also sheet 48
MIC: C420.1 CON34.1 R244.2 R247.1
N$51: CON30.17 RN56.9
N$79: C422.1 R250.2
N$379: IC283.13(A:I) RN53.2 RN55.1
N$507: IC285.2(A:-IN) R245.2 R250.1
N$508: CON35.1 R240.2
N$509: CON35.3 R241.2
N$527: IC285.5(B:+IN) R238.1 R246.2
N$769: IC285.7(B:OUT) R237.2 R246.1
N$770: R237.1 TR8.B
N$771: C421.1 IC285.3(A:+IN) IC285.6(B:-IN) R248.2 R249.1
N$790: CON35.5 R242.2
N$791: IC285.1(A:OUT) R238.2 R245.1
N$792: CON29.3 RN55.16
N$858: CON35.9 R243.2
N$859: CON29.5 RN55.15
N$860: CON29.7 RN55.14
N$868: CON29.9 RN55.13
N$869: CON29.11 RN55.12
N$871: CON29.13 RN55.11
N$872: CON29.15 RN55.10
N$873: IC283.11(B:I) RN53.3 RN55.2
N$874: IC283.9(C:I) RN53.4 RN55.3
N$875: IC283.1(D:I) RN53.5 RN55.4
N$876: CON29.17 RN55.9
N$877: CON30.9 RN56.13
N$879: CON30.3 RN56.16
N$880: CON30.5 RN56.15
N$881: CON30.7 RN56.14
N$882: CON30.11 RN56.12
N$883: IC283.3(E:I) RN53.6 RN55.5
N$884: IC283.5(F:I) RN53.7 RN55.6
N$885: CON30.13 RN56.11
N$886: IC284.13(A:I) RN54.2 RN56.1
N$887: IC284.11(B:I) RN54.3 RN56.2
N$897: IC284.9(C:I) RN54.4 RN56.3
N$898: IC284.1(D:I) RN54.5 RN56.4
N$899: IC284.3(E:I) RN54.6 RN56.5
N$901: CON30.15 RN56.10
N$903: CON35.7 R251.2
N$920: IC284.5(F:I) RN54.7 RN56.6
VCC [low power]: C418.2 C419.2 C423.2 CON29.1 CON30.1 CON32.7 CON33.7 R248.1 RN53.1 RN54.1 RN57.1 RN58.1 ; also sheet 2,3,4,6,7,8,9,10,11,12,13,14,15,16,17,18,19,20,21,22,24,25,26,27,28,29,30,31,34,35,36,37,38,39,40,41,42,43,44,45,46,47,48
Unconnected: CON32.5 CON32.9 CON33.5 CON33.9

### Buses
GPOA[0..15]
GPIA[0..15]
GPIB[0..15]
GPOB[0..15]

### Notes on the sheet
- Printer
- !STROBE | D0
- D1 | D2
- D3 | D4
- D5 | D6
- D7 | !ACK | Front Panel GP LEDs
- BUSY | PE
- SEL | !AUTOFD
- !ERROR | !INIT
- !SELIN
- User port 0
- Tape read data
- Tape output attenuator
- ~1.5V peak to peak
- Joystick 0 (L)
- Tape
- Up | Down
- Left | Right | Write to tape
- Pot B | Button
- Pot A | Read from tape
- User port 1
- Joystick 1 (R)
- Up | Down
- Left | Right
- Pot B | Button
- Pot A
- Tape input amplifier
- Decoupling
- TODO:
- * Write & Verify Verilog Model
- * DRC
- D